# Altium project REUN.468349.001_PSU_Board.PrjPcb
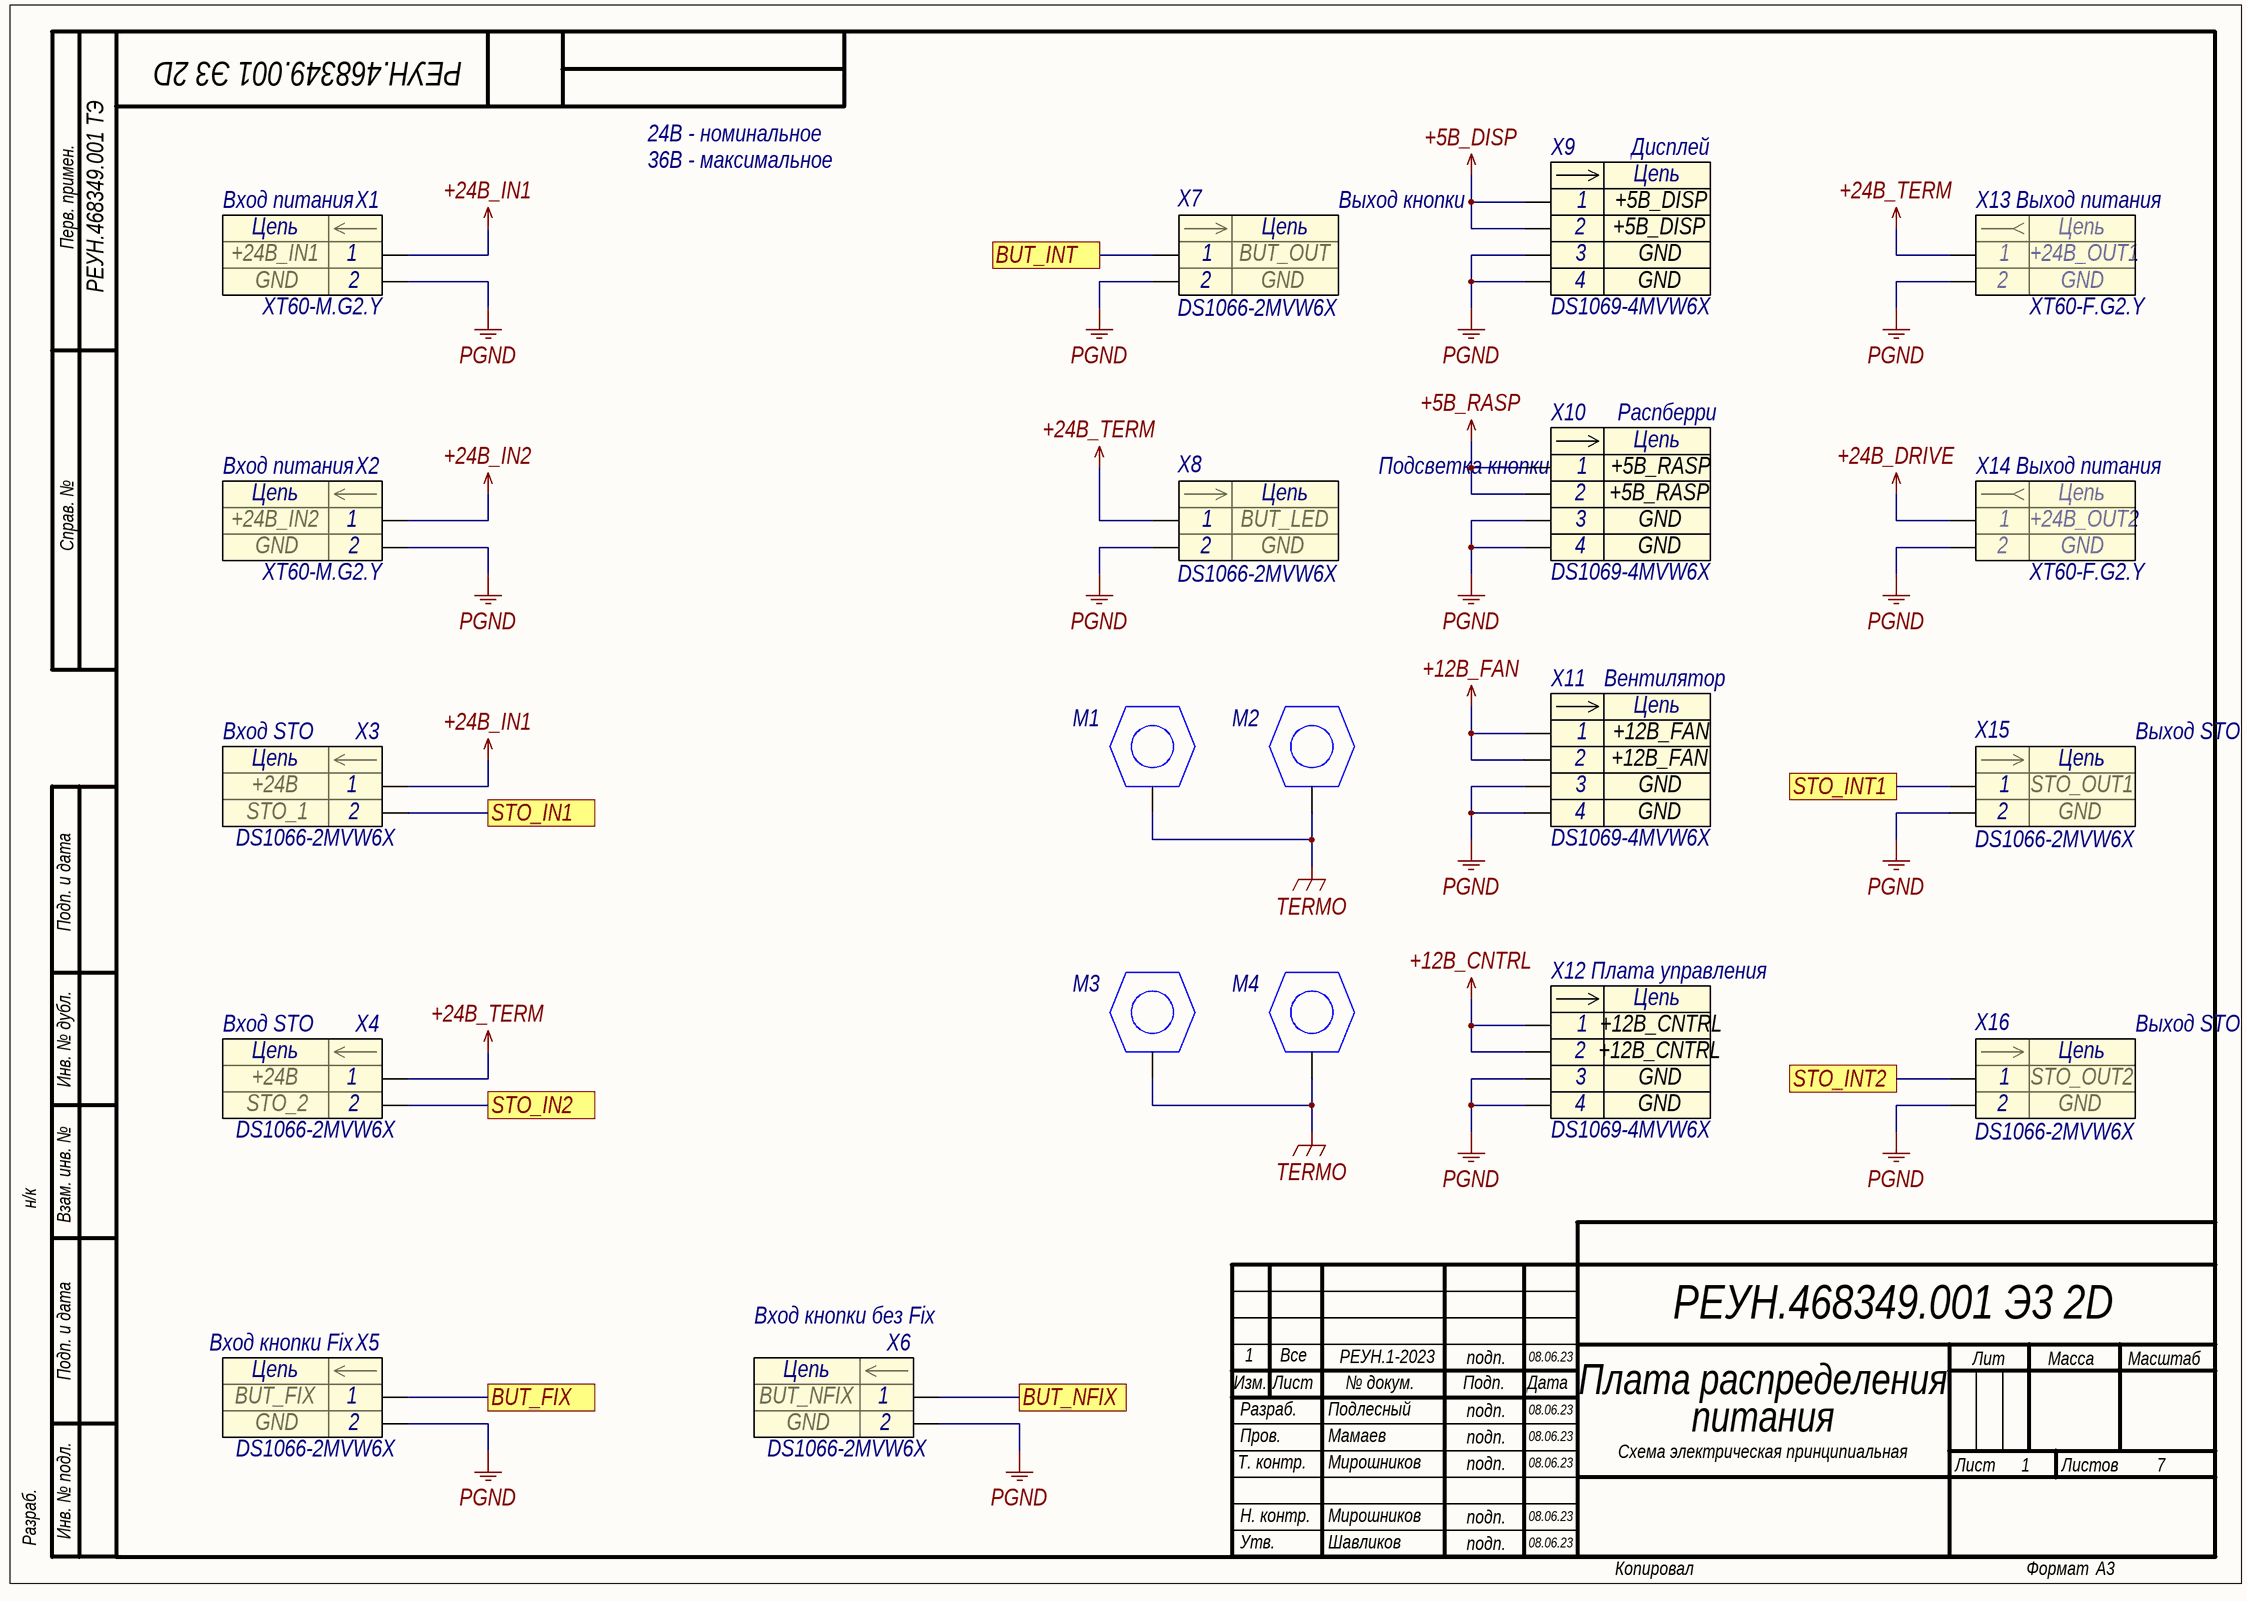
[diagram p0: REUN.468349.001_PSU_Board_Connectors.SchDoc]
BOM_Revision: Rev_1.2; Developer: Подлесный; PCB_Revision: Rev_1.2; SCH_Revision: Rev_1.2; Вид_документа_SCH: Схема электрическая принципиальная; Код_документа_SCH: Э3; Наименование: Плата распределения питания; Наименование1: Плата распределения питания; Обозначение: РЕУН.468349.001 Э3; Обозначение_Код: РЕУН.468349.001 Э3Э3; Перв.Примен.: РЕУН.468349.001; ПервПримен: РЕУН.468349.001; п_Пров_Р: Шавликов; п_Разраб_Р: Подлесный; п_Утв_Р: Шавликов
7 sheets, 182 parts. Net scope: flat (ports and power ports of the same name join across sheets).
Board file: REUN.468349.001_PSU_Board.PcbDoc
Sheets:
  REUN.468349.001_PSU_Board_Connectors.SchDoc
  REUN.468349.001_PSU_Board_Power.SchDoc
  REUN.468349.001_PSU_Board_Logic.SchDoc
  REUN.468349.001_PSU_Board_Button.SchDoc
  REUN.468349.001_PSU_Board_3V3_Logic.SchDoc
  REUN.468349.001_PSU_Board_5B_Interface.SchDoc
  REUN.468349.001_PSU_Board_12B_Interface.SchDoc

## Sheet REUN.468349.001_PSU_Board_Connectors.SchDoc: Плата распределения
size 420 x 297 mm; Date: 10.06.22; ApprovedBy: Шавликов; CheckedBy: Мамаев; DrawnBy: Подлесный; DocumentNumber: РЕУН.468349.001 Э3 2D; SheetNumber: 1; SheetTotal: 7; Title1str: питания; DocumentType: Схема электрическая принципиальная; Format: A3; ImagePath: РЕУН.468349.001 ТЭ

### Parts
M1  SCREW  [SCREW3.5]  (value not drawn)
M2  SCREW  [SCREW3.5]  (value not drawn)
M3  SCREW  [SCREW3.5]  (value not drawn)
M4  SCREW  [SCREW3.5]  (value not drawn)
X1  XT60-M.G2.Y  [XT60-M_TH]
X2  XT60-M.G2.Y  [XT60-M_TH]
X3  DS1066-2MVW6X  [MW-2M]
X4  DS1066-2MVW6X  [MW-2M]
X5  DS1066-2MVW6X  [MW-2M]
X6  DS1066-2MVW6X  [MW-2M]
X7  DS1066-2MVW6X  [MW-2M]
X8  DS1066-2MVW6X  [MW-2M]
X9  DS1069-4MVW6X  [CWF-4]
X10  DS1069-4MVW6X  [CWF-4]
X11  DS1069-4MVW6X  [CWF-4]
X12  DS1069-4MVW6X  [CWF-4]
X13  XT60-F.G2.Y  [XT60-F_TH]
X14  XT60-F.G2.Y  [XT60-F_TH]
X15  DS1066-2MVW6X  [MW-2M]
X16  DS1066-2MVW6X  [MW-2M]

### Ports
BUT_FIX, BUT_INT, BUT_NFIX, STO_IN1, STO_IN2, STO_INT1, STO_INT2

### Nets
+5B_DISP: X9.1 X9.2
+5B_RASP: X10.1 X10.2
+12B_CNTRL: X12.1 X12.2
+12B_FAN: X11.1 X11.2
+24B_DRIVE: X14.1
+24B_IN1: X1.1 X3.1
+24B_IN2: X2.1
+24B_TERM: X4.1 X8.1 X13.1
PGND: X1.2 X2.2 X5.2 X6.2 X7.2 X8.2 X9.3 X9.4 X10.3 X10.4 X11.3 X11.4 X12.3 X12.4 X13.2 X14.2 X15.2 X16.2
TERMO: M1.1 M2.1 M3.1 M4.1
NetDD4_5: X7.1 ; port BUT_INT
NetFU3_2: X15.1 ; port STO_INT1
NetFU4_2: X16.1 ; port STO_INT2
NetR19_1: X6.1 ; port BUT_NFIX
NetR21_1: X5.1 ; port BUT_FIX
NetVD7_2: X3.2 ; port STO_IN1
NetVD8_2: X4.2 ; port STO_IN2

### Notes on the sheet
- Перв. примен.
- 24В - номинальное
- 36В - максимальное
- Дисплей
- (near X1) Вход питания
- (near X7) Выход кнопки
- Выход питания
- Распберри
- Справ. №
- (near X2) Вход питания
- (near X8) Подсветка кнопки
- Вентилятор
- Вход STO
- Выход STO
- Подп. и дата
- Плата управления
- Инв. № дубл.
- н/к
- Взам. инв. №
- Вход кнопки без Fix
- (near X5) Вход кнопки Fix
- 1
- Изм.
- Все
- Лист
- РЕУН.1-2023
- № докум.
- подп.
- Подп.
- 08.06.23
- Дата
- Лит
- Масса
- Масштаб
- Т. контр.
- Пров.
- Разраб.
- Мирошников
- Листов
- Инв. № подл.
- Н. контр.
- Утв.
- Копировал
- Формат
- (in symbol connect76) Цепь
- (in symbol connect215) Цепь
- (in symbol connect216) Цепь
- (in symbol connect233) Цепь

### Library data of the parts
X1 = connect216: Разъем - 2 конт. вилка; Part Name: XT60-M; Manufacture: Amass Electronics; Contact_1: +24B_IN1; Contact_2: GND; Etch: 7.2mm; id: connect216; Part Number: XT60-M.G2.Y
X2 = connect216: Разъем - 2 конт. вилка; Part Name: XT60-M; Manufacture: Amass Electronics; Contact_1: +24B_IN2; Contact_2: GND; Etch: 7.2mm; id: connect216; Part Number: XT60-M.G2.Y
X3 = connect76: Разъем - 2 конт. вилка; Part Name: Вилка на плату прямая 2мм 2pin; Manufacture: Ningbo connfly electronic; Contact_1: +24В; Contact_2: STO_1; Etch: 2mm; id: connect76; Part Number: DS1066-2MVW6X
X4 = connect76: Разъем - 2 конт. вилка; Part Name: Вилка на плату прямая 2мм 2pin; Manufacture: Ningbo connfly electronic; Contact_1: +24В; Contact_2: STO_2; Etch: 2mm; id: connect76; Part Number: DS1066-2MVW6X
X5 = connect76: Разъем - 2 конт. вилка; Part Name: Вилка на плату прямая 2мм 2pin; Manufacture: Ningbo connfly electronic; Contact_1: BUT_FIX; Contact_2: GND; Etch: 2mm; id: connect76; Part Number: DS1066-2MVW6X
X6 = connect76: Разъем - 2 конт. вилка; Part Name: Вилка на плату прямая 2мм 2pin; Manufacture: Ningbo connfly electronic; Contact_1: BUT_NFIX; Contact_2: GND; Etch: 2mm; id: connect76; Part Number: DS1066-2MVW6X
X7 = connect76: Разъем - 2 конт. вилка; Part Name: Вилка на плату прямая 2мм 2pin; Manufacture: Ningbo connfly electronic; Contact_1: BUT_OUT; Contact_2: GND; Etch: 2mm; id: connect76; Part Number: DS1066-2MVW6X
X8 = connect76: Разъем - 2 конт. вилка; Part Name: Вилка на плату прямая 2мм 2pin; Manufacture: Ningbo connfly electronic; Contact_1: BUT_LED; Contact_2: GND; Etch: 2mm; id: connect76; Part Number: DS1066-2MVW6X
X9 = connect233: Разъем - 4 конт. вилка; Part Name: Вилка прямая на плату; Manufacture: Connfly electronic; Contact_1: +5B_DISP; Contact_3: GND; Etch: 2.5мм; Contact_2: +5B_DISP; Contact_4: GND; id: connect233; Part Number: DS1069-4MVW6X
X10 = connect233: Разъем - 4 конт. вилка; Part Name: Вилка прямая на плату; Manufacture: Connfly electronic; Contact_1: +5B_RASP; Contact_3: GND; Etch: 2.5мм; Contact_2: +5B_RASP; Contact_4: GND; id: connect233; Part Number: DS1069-4MVW6X
X11 = connect233: Разъем - 4 конт. вилка; Part Name: Вилка прямая на плату; Manufacture: Connfly electronic; Contact_1: +12B_FAN; Contact_3: GND; Etch: 2.5мм; Contact_2: +12B_FAN; Contact_4: GND; id: connect233; Part Number: DS1069-4MVW6X
X12 = connect233: Разъем - 4 конт. вилка; Part Name: Вилка прямая на плату; Manufacture: Connfly electronic; Contact_1: +12B_CNTRL; Contact_3: GND; Etch: 2.5мм; Contact_2: +12B_CNTRL; Contact_4: GND; id: connect233; Part Number: DS1069-4MVW6X
X13 = connect215: Разъем - 2 конт. розетка; Part Name: XT60-F; Manufacture: Amass Electronics; Contact_1: +24B_OUT1; Contact_2: GND; Etch: 7.2mm; id: connect215; Part Number: XT60-F.G2.Y
X14 = connect215: Разъем - 2 конт. розетка; Part Name: XT60-F; Manufacture: Amass Electronics; Contact_1: +24B_OUT2; Contact_2: GND; Etch: 7.2mm; id: connect215; Part Number: XT60-F.G2.Y
X15 = connect76: Разъем - 2 конт. вилка; Part Name: Вилка на плату прямая 2мм 2pin; Manufacture: Ningbo connfly electronic; Contact_1: STO_OUT1; Contact_2: GND; Etch: 2mm; id: connect76; Part Number: DS1066-2MVW6X
X16 = connect76: Разъем - 2 конт. вилка; Part Name: Вилка на плату прямая 2мм 2pin; Manufacture: Ningbo connfly electronic; Contact_1: STO_OUT2; Contact_2: GND; Etch: 2mm; id: connect76; Part Number: DS1066-2MVW6X

## Sheet REUN.468349.001_PSU_Board_Power.SchDoc
size 420 x 297 mm; DocumentNumber: РЕУН.468349.001 Э3 2D; SheetNumber: 2; Format: A3
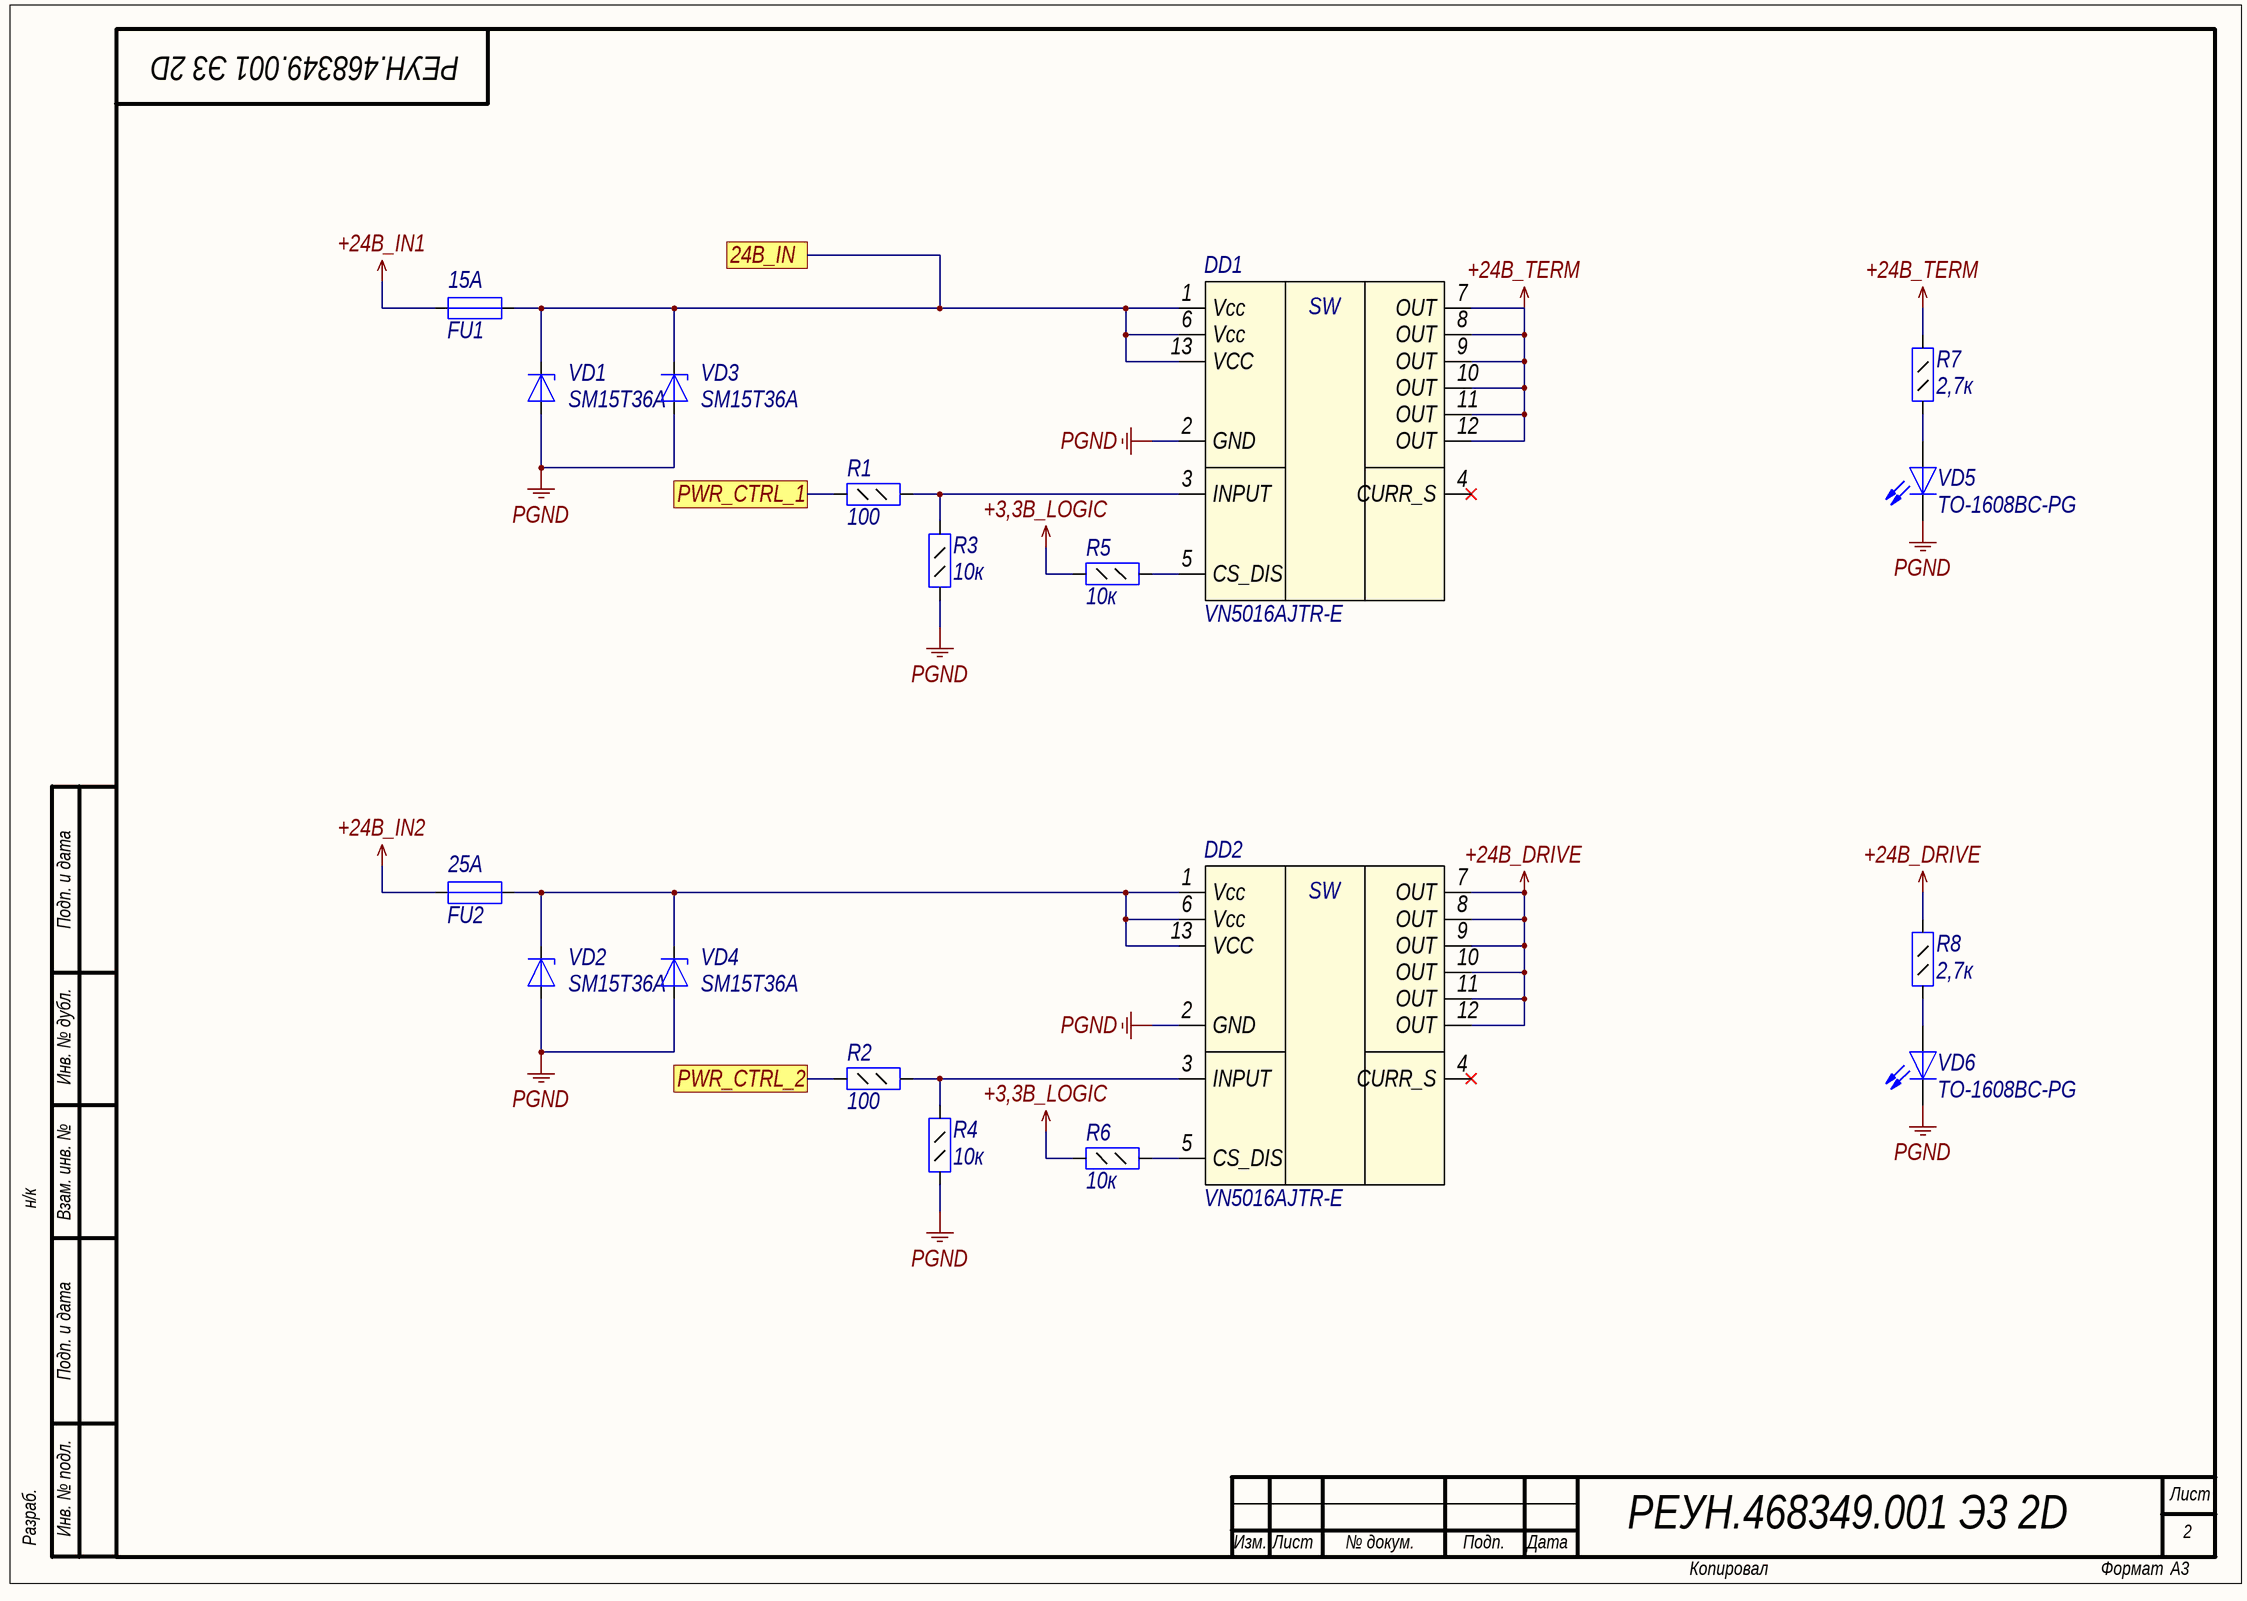
[diagram p1: REUN.468349.001_PSU_Board_Power.SchDoc]

### Parts
DD1  VN5016AJTR-E  [POWERSO12]
DD2  VN5016AJTR-E  [POWERSO12]
FU1  I max: 15А  [F6.3x32]  (hidden comment: Fuse)
FU2  I max: 25A  [F6.3x30]  (hidden comment: Fuse)
R1  value 100  [R0805]  (hidden comment: Resistor_0,125Вт)
R2  value 100  [R0805]  (hidden comment: Resistor_0,125Вт)
R3  value 10к  [R0805]  (hidden comment: Resistor_0,125Вт)
R4  value 10к  [R0805]  (hidden comment: Resistor_0,125Вт)
R5  value 10к  [R0805]  (hidden comment: Resistor_0,125Вт)
R6  value 10к  [R0805]  (hidden comment: Resistor_0,125Вт)
R7  value 2,7к  [R0805]  (hidden comment: Resistor_0,125Вт)
R8  value 2,7к  [R0805]  (hidden comment: Resistor_0,125Вт)
VD1  SM15T36A  [SMC]
VD2  SM15T36A  [SMC]
VD3  SM15T36A  [SMC]
VD4  SM15T36A  [SMC]
VD5  TO-1608BC-PG  [L_0603_GREEN]
VD6  TO-1608BC-PG  [L_0603_GREEN]

### Ports
24B_IN, PWR_CTRL_1, PWR_CTRL_2

### Nets
+3,3B_LOGIC: R5.1 R6.1
+24B_DRIVE: DD2.7(OUT) DD2.8(OUT) DD2.9(OUT) DD2.10(OUT) DD2.11(OUT) DD2.12(OUT) R8.2
+24B_IN1: FU1.1
+24B_IN2: FU2.1
+24B_TERM: DD1.7(OUT) DD1.8(OUT) DD1.9(OUT) DD1.10(OUT) DD1.11(OUT) DD1.12(OUT) R7.2
PGND: DD1.2(GND) DD2.2(GND) R3.1 R4.1 VD1.2(A) VD2.2(A) VD3.2(A) VD4.2(A) VD5.1(K) VD6.1(K)
NetC12_1: DD1.1(Vcc) DD1.6(Vcc) DD1.13(VCC) FU1.2 VD1.1(K) VD3.1(K) ; port 24B_IN
NetDD1_3: DD1.3(INPUT) R1.2 R3.2
NetDD1_5: DD1.5(CS_DIS) R5.2
NetDD2_1: DD2.1(Vcc) DD2.6(Vcc) DD2.13(VCC) FU2.2 VD2.1(K) VD4.1(K)
NetDD2_3: DD2.3(INPUT) R2.2 R4.2
NetDD2_5: DD2.5(CS_DIS) R6.2
NetDD3_3: R1.1 ; port PWR_CTRL_1
NetDD3_6: R2.1 ; port PWR_CTRL_2
NetR7_1: R7.1 VD5.2(A)
NetR8_1: R8.1 VD6.2(A)

Not connected (* = marked no-connect by the designer): DD1 4(CURR_S)*; DD2 4(CURR_S)*

### Notes on the sheet
- Подп. и дата
- Инв. № дубл.
- н/к
- Взам. инв. №
- Разраб.
- Инв. № подл.
- Лист
- Изм.
- № докум.
- Подп.
- Дата
- Копировал
- Формат
- (in symbol pwrsw5) SW

### Library data of the parts
DD1 DD2 = pwrsw5: Single channel high side driver with analog / current sense for automotive applications; Manufacturer: STMicroelectronics; Overvoltage protection: 36B; Output clamp: 52В; Operating voltage: 4,5-36B; On-state resistance: 0,016Ohm; Load current: 65A; Input Logic: 3B CMOS; Short circuit: 91А; Current sense ratio: 45000; id: pwrsw5; Part Name: Driver with analog current sense; Part Number: VN5016AJTR-E
FU1 = fuse26: Предохранитель; Part Name: Glass Miniature Fuse-Links; Manufacture: Siba; Part Number: 189000.15; id: fuse26; V max: 250В; Slow blow(min): 80ms 10*I
FU2 = fuse28: Предохранитель; Part Name: Fast Blow Fuse; Manufacture: KLS electronic co ltd; Part Number: KLS5-1046-25000; id: fuse28; V max: 250В
R1 R2 = res49: Резистор; Manufacture: Yageo; Part Number: RC0805FR-07100RL; id: res49; Accuracy: 0.01; Part Name: Resistor; Power: 0,125Вт
R3-R6 = res101: Резистор; Manufacture: Yageo; Part Number: RC0805FR-0710KL; id: res101; Accuracy: 0.01; Part Name: Resistor; Power: 0,125Вт
R7 R8 = res87: Резистор; Manufacture: Yageo; Part Number: RC0805FR-072K7; id: res87; Accuracy: 0.01; Part Name: Resistor; Power: 0,125Вт
VD1-VD4 = SM15T36A: Cтабилитрон (лавинный выпрямительный диод) односторонний; Part Name: TVS diode Unidirectional; Manufacture: ST Microelectronics; id: tvs258; Leakage Current: 0.2uA; Stand-off Voltage: 34.2B; Breakdown Voltage: 36B; Clamping voltage: 37.8B; Peak Pulse Power: 1500W; Number of diodes: 1; Part Number: SM15T36A
VD5 VD6 = diode43: Светодиод; Part Name: LED green 0603; Manufacture: OASISTEK; id: diode43; Part Number: TO-1608BC-PG

## Sheet REUN.468349.001_PSU_Board_Logic.SchDoc
size 420 x 297 mm; DocumentNumber: РЕУН.468349.001 Э3 2D; SheetNumber: 3; Format: A3
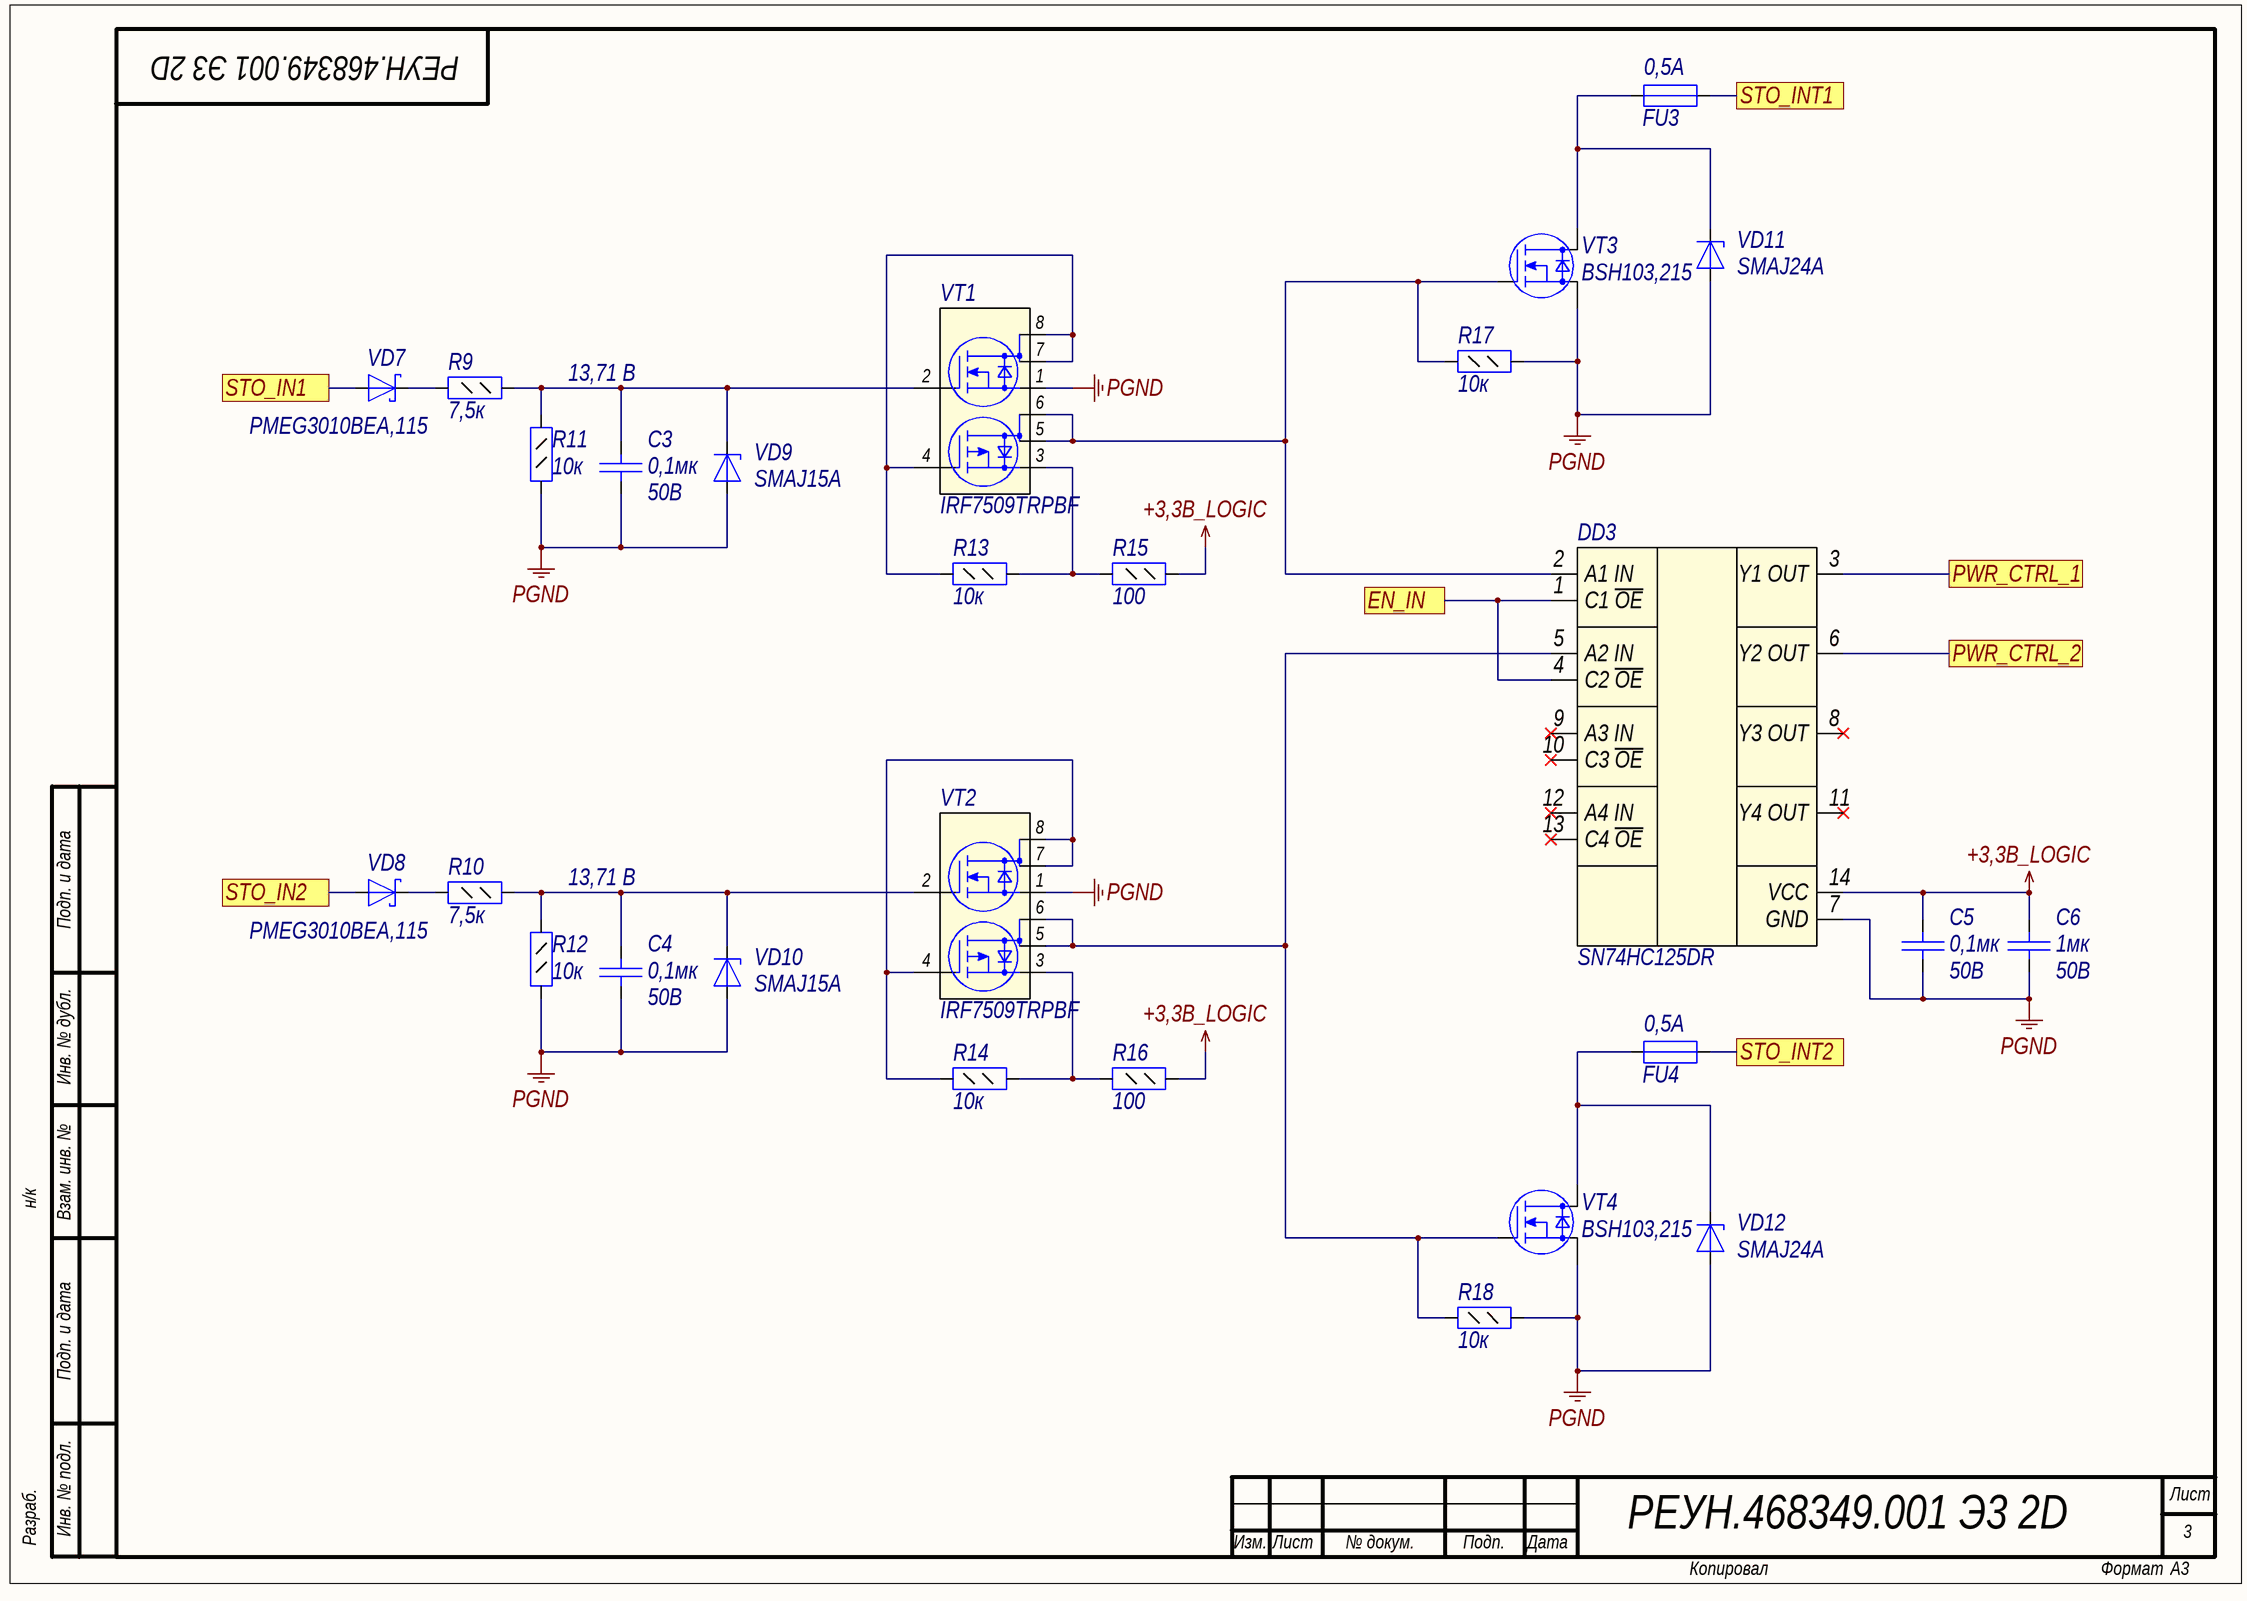
[diagram p2: REUN.468349.001_PSU_Board_Logic.SchDoc]

### Parts
C3  Voltage: 50B  [C0805]  (hidden comment: 0,1мк)
C4  Voltage: 50B  [C0805]  (hidden comment: 0,1мк)
C5  Voltage: 50B  [C0805]  (hidden comment: 0,1мк)
C6  Voltage: 50B  [C0805]  (hidden comment: 1мк)
DD3  SN74HC125DR  [SO14]
FU3  I hold: 0,5A  [FUSE812]  (hidden comment: Fuse)
FU4  I hold: 0,5A  [FUSE812]  (hidden comment: Fuse)
R9  value 7,5к  [R0805]  (hidden comment: Resistor_0,125Вт)
R10  value 7,5к  [R0805]  (hidden comment: Resistor_0,125Вт)
R11  value 10к  [R0805]  (hidden comment: Resistor_0,125Вт)
R12  value 10к  [R0805]  (hidden comment: Resistor_0,125Вт)
R13  value 10к  [R0805]  (hidden comment: Resistor_0,125Вт)
R14  value 10к  [R0805]  (hidden comment: Resistor_0,125Вт)
R15  value 100  [R0805]  (hidden comment: Resistor_0,125Вт)
R16  value 100  [R0805]  (hidden comment: Resistor_0,125Вт)
R17  value 10к  [R0805]  (hidden comment: Resistor_0,125Вт)
R18  value 10к  [R0805]  (hidden comment: Resistor_0,125Вт)
VD7  PMEG3010BEA,115  [SOD-323]
VD8  PMEG3010BEA,115  [SOD-323]
VD9  SMAJ15A  [SMA]
VD10  SMAJ15A  [SMA]
VD11  SMAJ24A  [SMA]
VD12  SMAJ24A  [SMA]
VT1  IRF7509TRPBF  [Micro8]
VT2  IRF7509TRPBF  [Micro8]
VT3  BSH103,215  [SOT23-3]
VT4  BSH103,215  [SOT23-3]

### Ports
EN_IN, PWR_CTRL_1, PWR_CTRL_2, STO_IN1, STO_IN2, STO_INT1, STO_INT2

### Nets
+3,3B_LOGIC: C5.2 C6.2 DD3.14(VCC) R15.1 R16.1
PGND: C3.1 C4.1 C5.1 C6.1 DD3.7(GND) R11.2 R12.2 R17.2 R18.2 VD9.2(A) VD10.2(A) VD11.2(A) VD12.2(A) VT1.1(S1) VT2.1(S1) VT3.2(S) VT4.2(S)
NetC3_2: C3.2 R9.1 R11.1 VD9.1(K) VT1.2(G1)
NetC4_2: C4.2 R10.1 R12.1 VD10.1(K) VT2.2(G1)
NetC11_2: DD3.1(C1_~{OE}) DD3.4(C2_~{OE}) ; port EN_IN
NetDD3_2: DD3.2(A1_IN) R17.1 VT1.5(D2) VT1.6(D2) VT3.1(G)
NetDD3_3: DD3.3(Y1_OUT) ; port PWR_CTRL_1
NetDD3_5: DD3.5(A2_IN) R18.1 VT2.5(D2) VT2.6(D2) VT4.1(G)
NetDD3_6: DD3.6(Y2_OUT) ; port PWR_CTRL_2
NetFU3_1: FU3.1 VD11.1(K) VT3.3(D)
NetFU3_2: FU3.2 ; port STO_INT1
NetFU4_1: FU4.1 VD12.1(K) VT4.3(D)
NetFU4_2: FU4.2 ; port STO_INT2
NetR9_2: R9.2 VD7.1(K)
NetR10_2: R10.2 VD8.1(K)
NetR13_1: R13.1 VT1.4(G2) VT1.7(D1) VT1.8(D1)
NetR13_2: R13.2 R15.2 VT1.3(S2)
NetR14_1: R14.1 VT2.4(G2) VT2.7(D1) VT2.8(D1)
NetR14_2: R14.2 R16.2 VT2.3(S2)
NetVD7_2: VD7.2(A) ; port STO_IN1
NetVD8_2: VD8.2(A) ; port STO_IN2

Not connected (* = marked no-connect by the designer): DD3 8(Y3_OUT)* 9(A3_IN)* 10(C3_~{OE})* 11(Y4_OUT)* 12(A4_IN)* 13(C4_~{OE})*

### Notes on the sheet
- 13,71 B
- Подп. и дата
- Инв. № дубл.
- н/к
- Взам. инв. №
- Разраб.
- Инв. № подл.
- Лист
- Изм.
- № докум.
- Подп.
- Дата
- Копировал
- Формат

### Library data of the parts
C3-C5 = cap141: Конденсатор; Part Name: Ceramic; Manufacture: Murata; Part Number: GRM21BR71H104KA01K; id: cap141; TKE: X7R; Value: 0,1мк
C6 = cap151: Конденсатор; Part Name: Ceramic; Manufacture: Murata; Part Number: GRM21BR71H105KA12L; id: cap151; TKE: X7R; Value: 1мк
DD3 = logic16: Quad Tri-State Buffer IC; Manufacture: Nexperia; Type of Logic: 3V3 CMOS; Number of elements: 4; Input High Level: 1,75B; Input Low Level: 1,55B; Output High Level: 3,3B; Output Low Level: 0,1B; Toff: 41ns; Power Supply: 2В-6В; id: logic16; Part Name: Quad Tri-State Buffer; Ton: 41ns; Part Number: SN74HC125DR; Temperature: -40...+125
FU3 FU4 = fuse8: Предохранитель; Part Name: Resettable Fuses; Manufacture: Bourns; Part Number: MF-MSMF050; id: fuse8; V max: 15B; I max: 100A; I trip: 1A; Resistance: 0,15Ohms
R9 R10 = res98: Резистор; Manufacture: Yageo; Part Number: RC0805FR-077K5; id: res98; Accuracy: 0.01; Part Name: Resistor; Power: 0,125Вт
R11-R14 R17 R18 = res101: as R3 on sheet REUN.468349.001_PSU_Board_Power; Part Name: Resistor; Power: 0,125Вт
R15 R16 = res49: as R1 on sheet REUN.468349.001_PSU_Board_Power; Part Name: Resistor; Power: 0,125Вт
VD7 VD8 = diode63: Диод Шоттки; Part Name: Diode Schottky; Manufacture: NXP Semiconductor; Max Reverse Voltage: 30B; Forward Voltage: 0,13B; Forward Current: 1А; Peak Current: 10A; Reverse Current: 1,5mA; Number: 1; id: diode63; Temp MAX: +150; Temp MIN: -65; Part Number: PMEG3010BEA,115
VD9 VD10 = SMAJ15A: Cтабилитрон (лавинный выпрямительный диод) односторонний; Part Name: TVS diode Unidirectional; Manufacture: ST Microelectronics; id: tvs130; Leakage Current: 0,2uA; Stand-off Voltage: 15B; Breakdown Voltage: 17,6B; Clamping voltage: 24,4B; Dynamic resistance: 0,361Ohm; Peak Pulse Power: 400W; Number of diodes: 1; Part Number: SMAJ15A
VD11 VD12 = SMAJ24A: Cтабилитрон (лавинный выпрямительный диод) односторонний; Part Name: TVS diode Unidirectional; Manufacture: ST Microelectronics; id: tvs134; Leakage Current: 0,2uA; Stand-off Voltage: 24B; Breakdown Voltage: 28,1B; Clamping voltage: 38,9B; Dynamic resistance: 0,912Ohm; Peak Pulse Power: 400W; Number of diodes: 1; Part Number: SMAJ24A
VT1 VT2 = mosfert3: Комплементарная сборка МОП; Manufacturer: International Rectifier; Structure: n-p-channel; V drain-source max: 30B; Rds: 0,11 Ohm; Gate-to-source voltage: (+-)20B; Continuous drain current: 2A; Pulsed drain current: 16A; Power dissipation: 1,25W; id: mosfert3; Part Number: IRF7509TRPBF
VT3 VT4 = mosfert36: N-MOSFET; Manufacturer: Nexperia; Structure: n-channel; V drain-source max: 30B; Rds: 0,5Ohm; Gate-to-source voltage: (+-)8B; Continuous drain current: 0,85A; Total gate charge: 2100pC; Pulsed drain current: 3,4A; Power dissipation: 0,5W; id: mosfert36; Part Number: BSH103,215

## Sheet REUN.468349.001_PSU_Board_Button.SchDoc
size 420 x 297 mm; DocumentNumber: РЕУН.468349.001 Э3 2D; SheetNumber: 4; Format: A3
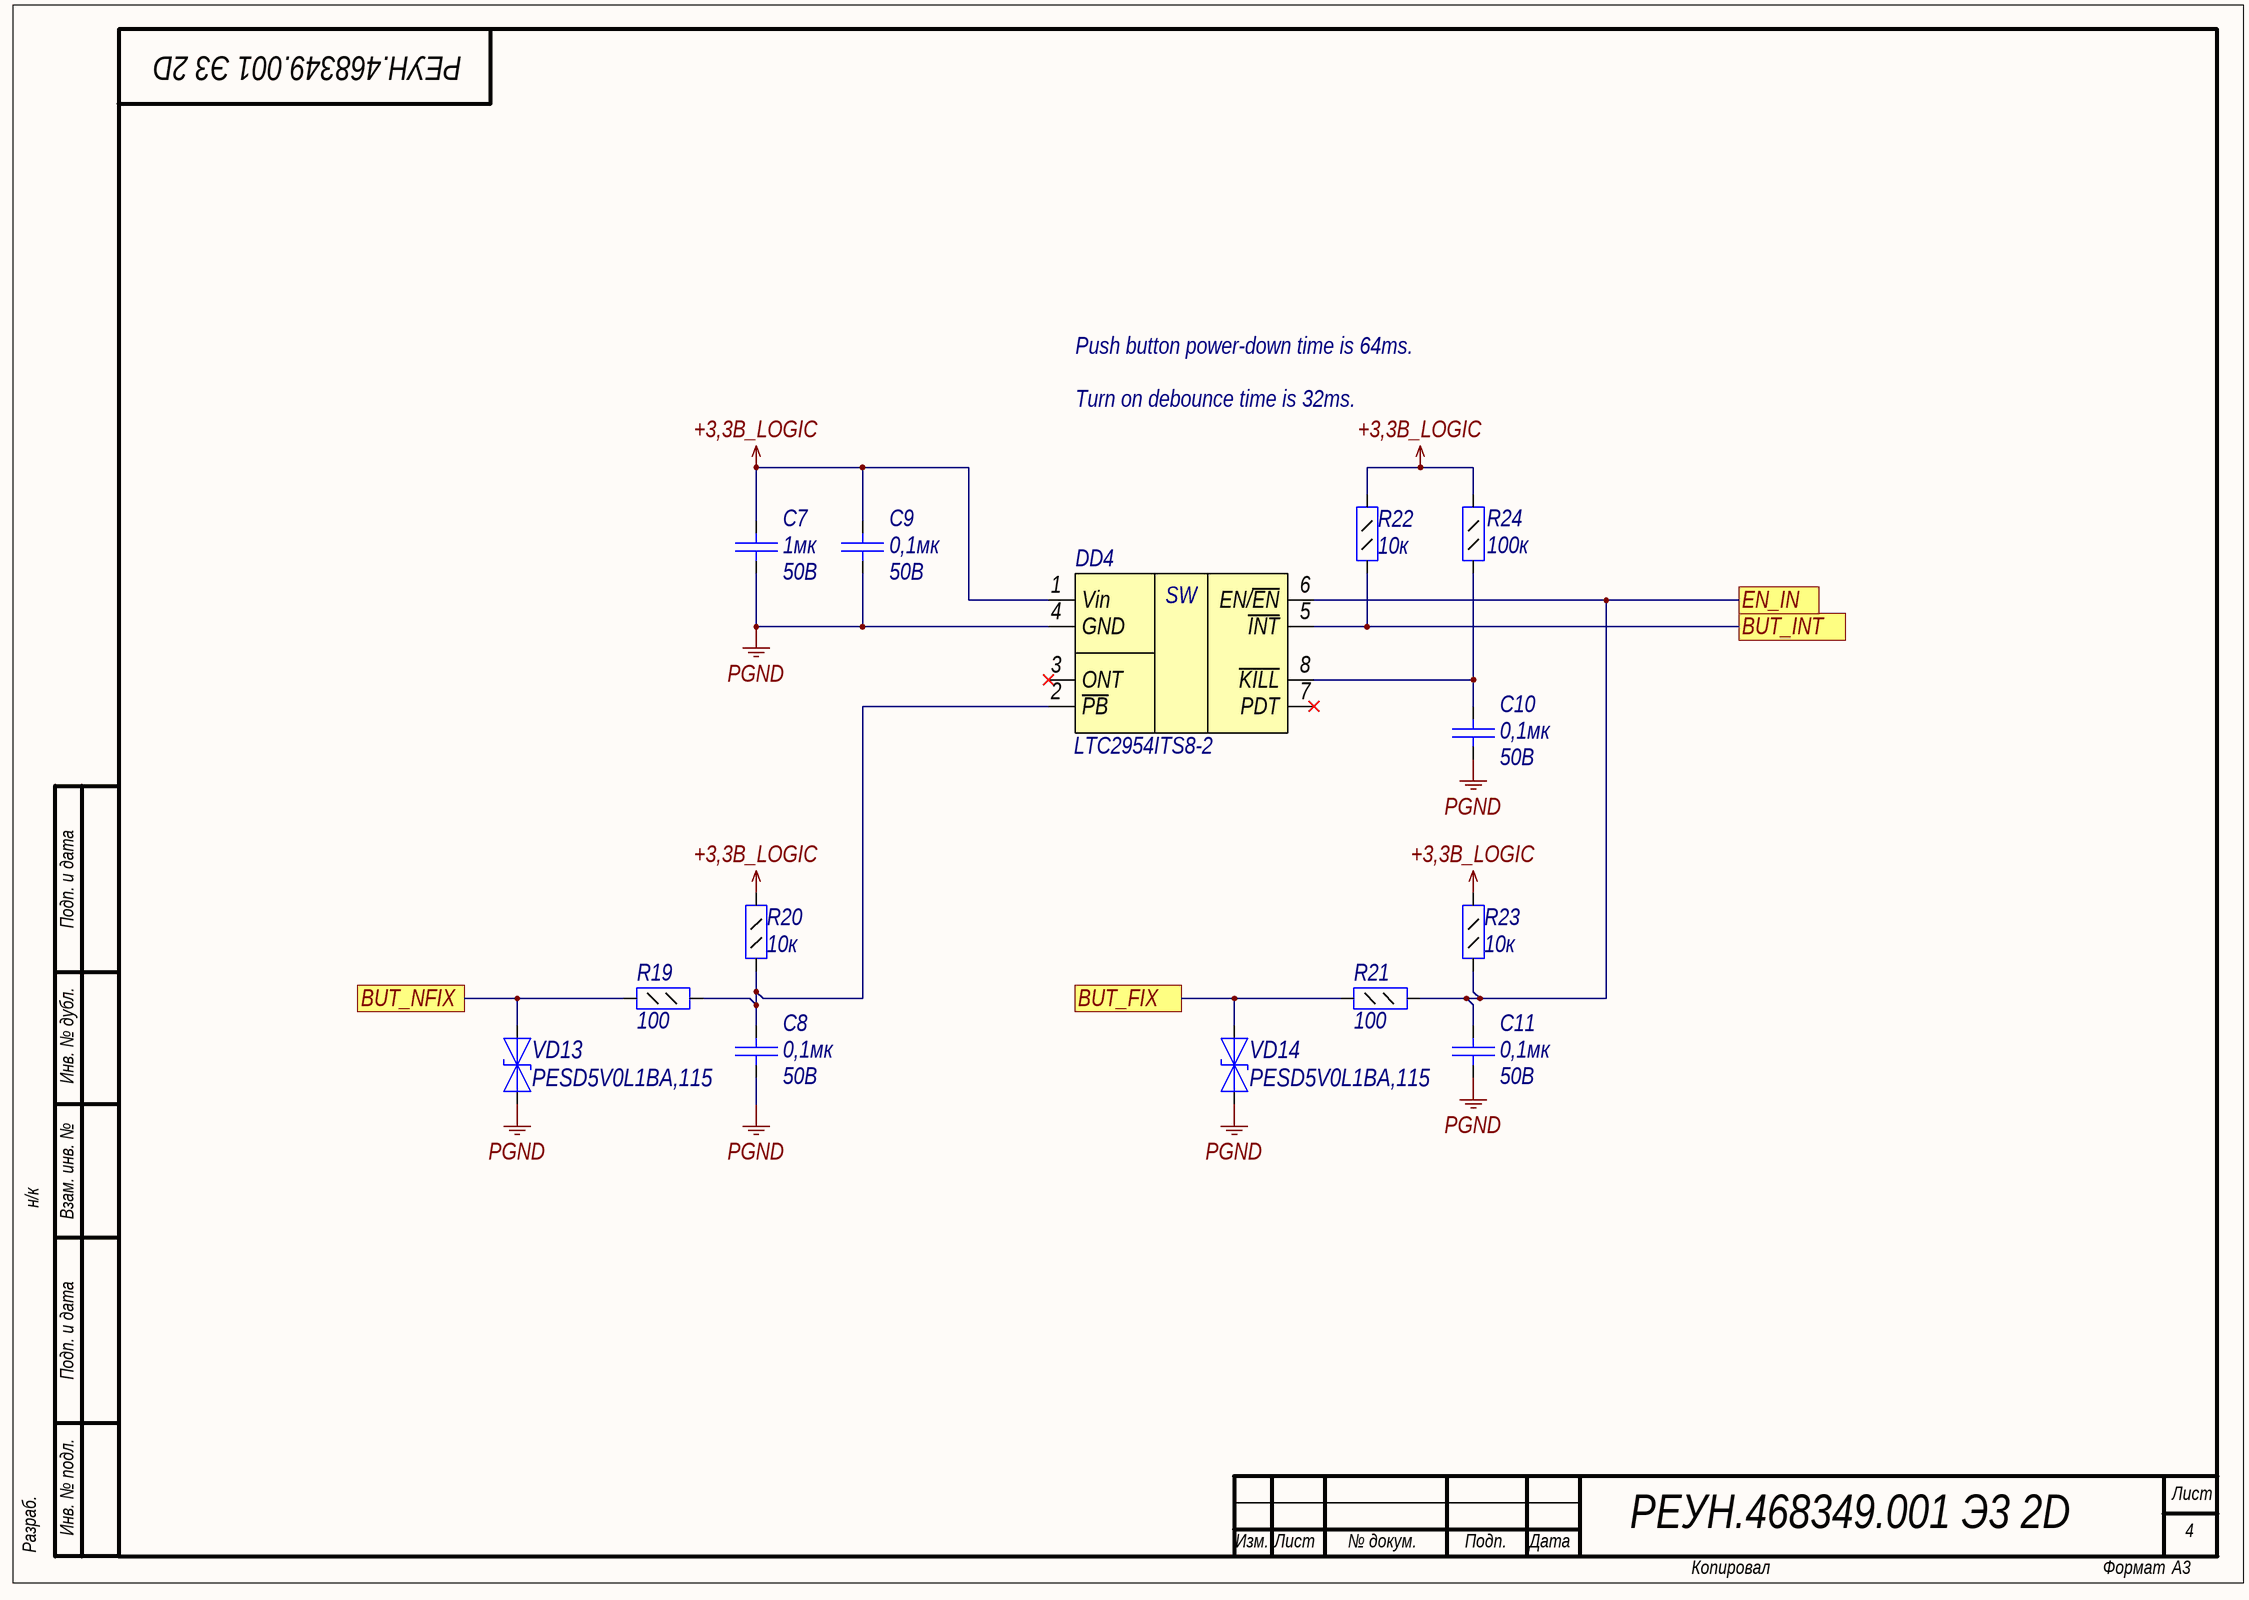
[diagram p3: REUN.468349.001_PSU_Board_Button.SchDoc]

### Parts
C7  Voltage: 50B  [C0805]  (hidden comment: 1мк)
C8  Voltage: 50B  [C0805]  (hidden comment: 0,1мк)
C9  Voltage: 50B  [C0805]  (hidden comment: 0,1мк)
C10  Voltage: 50B  [C0805]  (hidden comment: 0,1мк)
C11  Voltage: 50B  [C0805]  (hidden comment: 0,1мк)
DD4  LTC2954ITS8-2  [SOT-23-8]
R19  value 100  [R0805]  (hidden comment: Resistor_0,125Вт)
R20  value 10к  [R0805]  (hidden comment: Resistor_0,125Вт)
R21  value 100  [R0805]  (hidden comment: Resistor_0,125Вт)
R22  value 10к  [R0805]  (hidden comment: Resistor_0,125Вт)
R23  value 10к  [R0805]  (hidden comment: Resistor_0,125Вт)
R24  value 100к  [R0805]  (hidden comment: Resistor_0,125Вт)
VD13  PESD5V0L1BA,115  [SOD-323]
VD14  PESD5V0L1BA,115  [SOD-323]

### Ports
BUT_FIX, BUT_INT, BUT_NFIX, EN_IN

### Nets
+3,3B_LOGIC: C7.2 C9.2 DD4.1(Vin) R20.2 R22.2 R23.2 R24.2
PGND: C7.1 C8.1 C9.1 C10.1 C11.1 DD4.4(GND) VD13.2(A) VD14.2(A)
NetC8_2: C8.2 DD4.2(~{PB}) R19.2 R20.1
NetC10_2: C10.2 DD4.8(~{KILL}) R24.1
NetC11_2: C11.2 DD4.6(EN/~{EN}) R21.2 R23.1 ; port EN_IN
NetDD4_5: DD4.5(~{INT}) R22.1 ; port BUT_INT
NetR19_1: R19.1 VD13.1(K) ; port BUT_NFIX
NetR21_1: R21.1 VD14.1(K) ; port BUT_FIX

Not connected (* = marked no-connect by the designer): DD4 3(ONT)* 7(PDT)*

### Notes on the sheet
- Push button power-down time is 64ms.
- Turn on debounce time is 32ms.
- Подп. и дата
- Инв. № дубл.
- н/к
- Взам. инв. №
- Разраб.
- Инв. № подл.
- Лист
- Изм.
- № докум.
- Подп.
- Дата
- Копировал
- Формат
- (in symbol btn11) SW

### Library data of the parts
C7 = cap151: as C6 on sheet REUN.468349.001_PSU_Board_Logic; Value: 1мк
C8-C11 = cap141: as C3 on sheet REUN.468349.001_PSU_Board_Logic; Value: 0,1мк
DD4 = btn11: Pushbutton On/Off Controller with µP Interrupt; Manufacture: Analog Devices; id: btn11; Part Name: Pushbutton On/Off Controller; Part Number: LTC2954ITS8-2
R19 = res49: Резистор; Manufacture: Yageo; Part Number: RC0805FR-07100RL; Accuracy: 0.01; id: res49; Part Name: Resistor; Power: 0,125Вт
R20 R22 R23 = res101: as R3 on sheet REUN.468349.001_PSU_Board_Power; Part Name: Resistor; Power: 0,125Вт
R21 = res49: as R1 on sheet REUN.468349.001_PSU_Board_Power; Part Name: Resistor; Power: 0,125Вт
R24 = res125: Резистор; Manufacture: Yageo; Part Number: RC0805FR-07100KL; id: res125; Accuracy: 0.01; Part Name: Resistor; Power: 0,125Вт
VD13 VD14 = PESD5V0L1BA,115: Cтабилитрон (диод выпрямительный лавинный) двусторонний; Part Name: TVS diode Bidirectional; Manufacture: Nexperia; id: tvs286; Leakage Current: 1uA; Stand-off Voltage: 5B; Breakdown Voltage: 8,2B; Clamping voltage: 10B; Peak Pulse Power: 500W; Number of diodes: 1; Part Number: PESD5V0L1BA,115

## Sheet REUN.468349.001_PSU_Board_3V3_Logic.SchDoc
size 420 x 297 mm; DocumentNumber: РЕУН.468349.001 Э3 2D; SheetNumber: 5; Format: A3
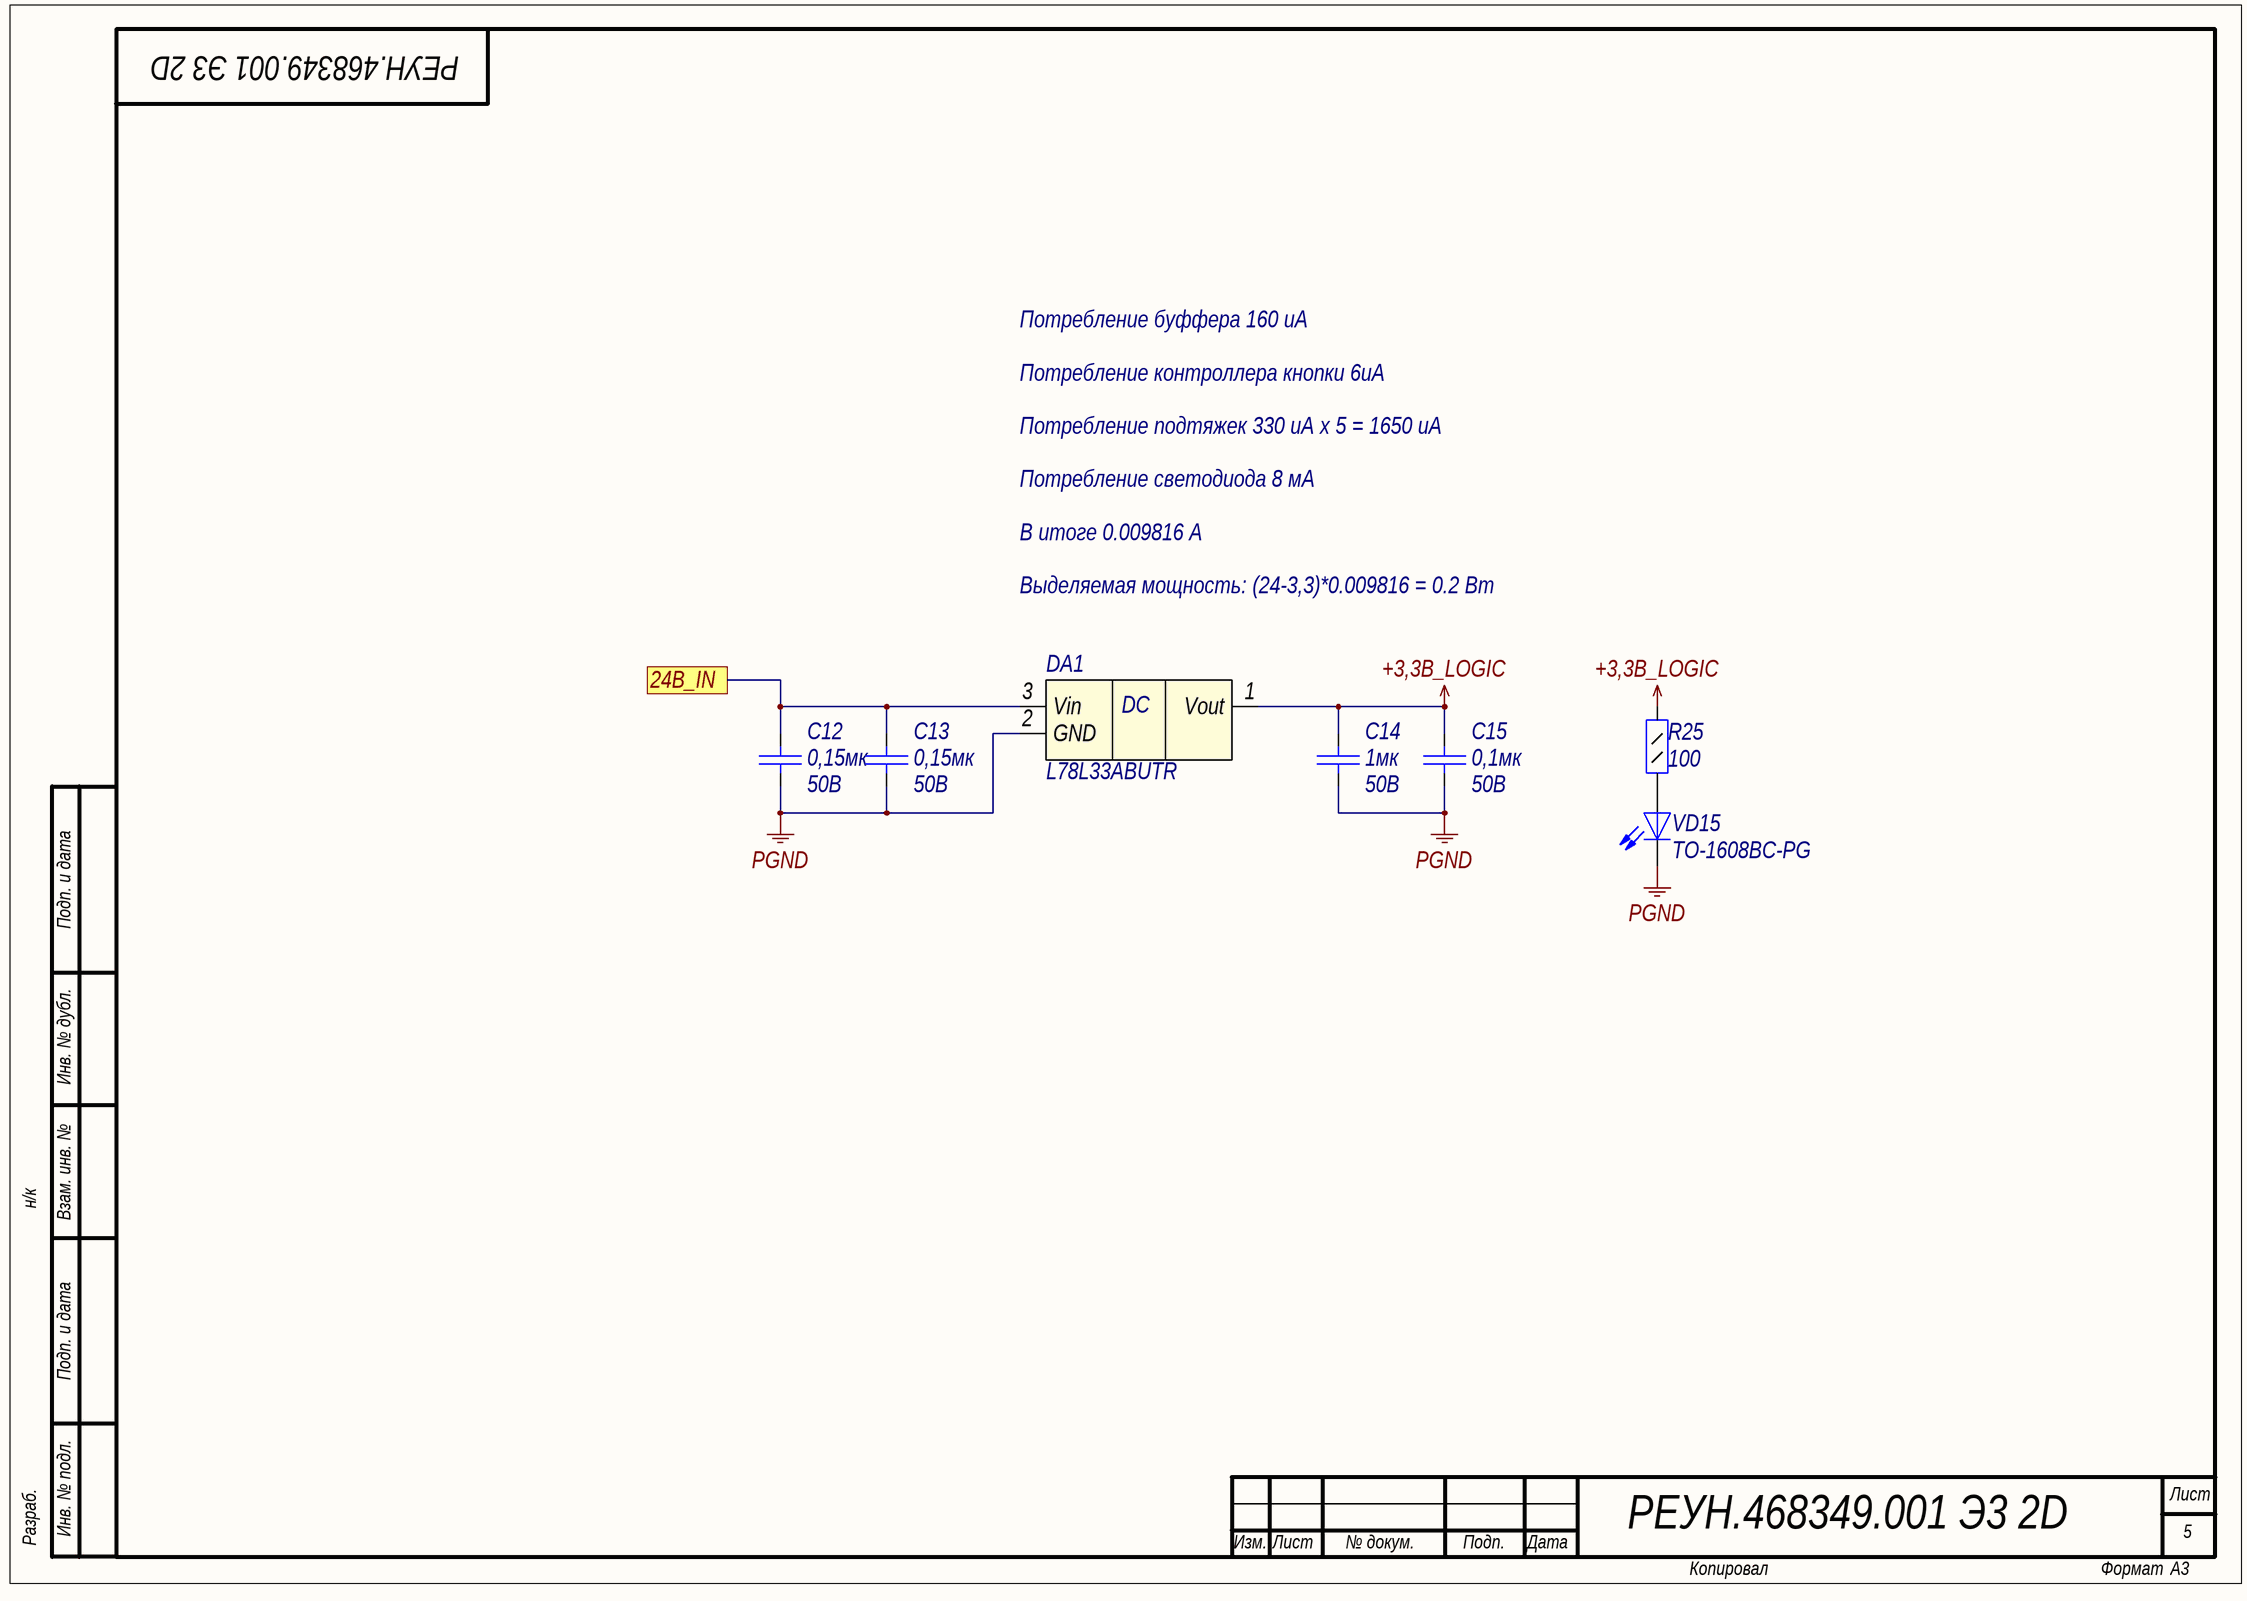
[diagram p4: REUN.468349.001_PSU_Board_3V3_Logic.SchDoc]

### Parts
C12  Voltage: 50B  [C0805]  (hidden comment: 0,15мк)
C13  Voltage: 50B  [C0805]  (hidden comment: 0,15мк)
C14  Voltage: 50B  [C0805]  (hidden comment: 1мк)
C15  Voltage: 50B  [C0805]  (hidden comment: 0,1мк)
DA1  L78L33ABUTR  [SOT-89-3]
R25  value 100  [R0805]  (hidden comment: Resistor_0,125Вт)
VD15  TO-1608BC-PG  [L_0603_GREEN]

### Ports
24B_IN

### Nets
+3,3B_LOGIC: C14.2 C15.2 DA1.1(Vout) R25.2
PGND: C12.2 C13.2 C14.1 C15.1 DA1.2(GND) VD15.1(K)
NetC12_1: C12.1 C13.1 DA1.3(Vin) ; port 24B_IN
NetR25_1: R25.1 VD15.2(A)

### Notes on the sheet
- Потребление буффера 160 uA
- Потребление контроллера кнопки 6uA
- Потребление подтяжек 330 uA x 5 = 1650 uA
- Потребление cветодиода 8 мА
- В итоге 0.009816 А
- Выделяемая мощность: (24-3,3)*0.009816 = 0.2 Вт
- Подп. и дата
- Инв. № дубл.
- н/к
- Взам. инв. №
- Разраб.
- Инв. № подл.
- Лист
- Изм.
- № докум.
- Подп.
- Дата
- Копировал
- Формат
- (in symbol pwr180) DC

### Library data of the parts
C12 C13 = cap142: Конденсатор; Part Name: Ceramic; Manufacture: Murata; Part Number: GRM21BR71H154K; id: cap142; TKE: X7R; Value: 0,15мк
C14 = cap151: as C6 on sheet REUN.468349.001_PSU_Board_Logic; Value: 1мк
C15 = cap141: as C3 on sheet REUN.468349.001_PSU_Board_Logic; Value: 0,1мк
DA1 = pwr180: Cтабилизатор напряжения (+3,3В; 0.1А), 4%, (-40...+125C); Part Name: Positive voltage regulators; Manufacturer: ST Microelectronics; id: pwr180; Input Voltage: 30B; Output Voltage: 3,3B; Dropout Voltage: 2V; Current: 100mA; Quiescent current: 6mA; Type: Linear; Part Number: L78L33ABUTR
R25 = res49: as R1 on sheet REUN.468349.001_PSU_Board_Power; Part Name: Resistor; Power: 0,125Вт
VD15 = diode43: as VD5 on sheet REUN.468349.001_PSU_Board_Power; id: diode43; Part Number: TO-1608BC-PG

## Sheet REUN.468349.001_PSU_Board_5B_Interface.SchDoc
size 420 x 297 mm; DocumentNumber: РЕУН.468349.001 Э3 2D; SheetNumber: 6; Format: A3
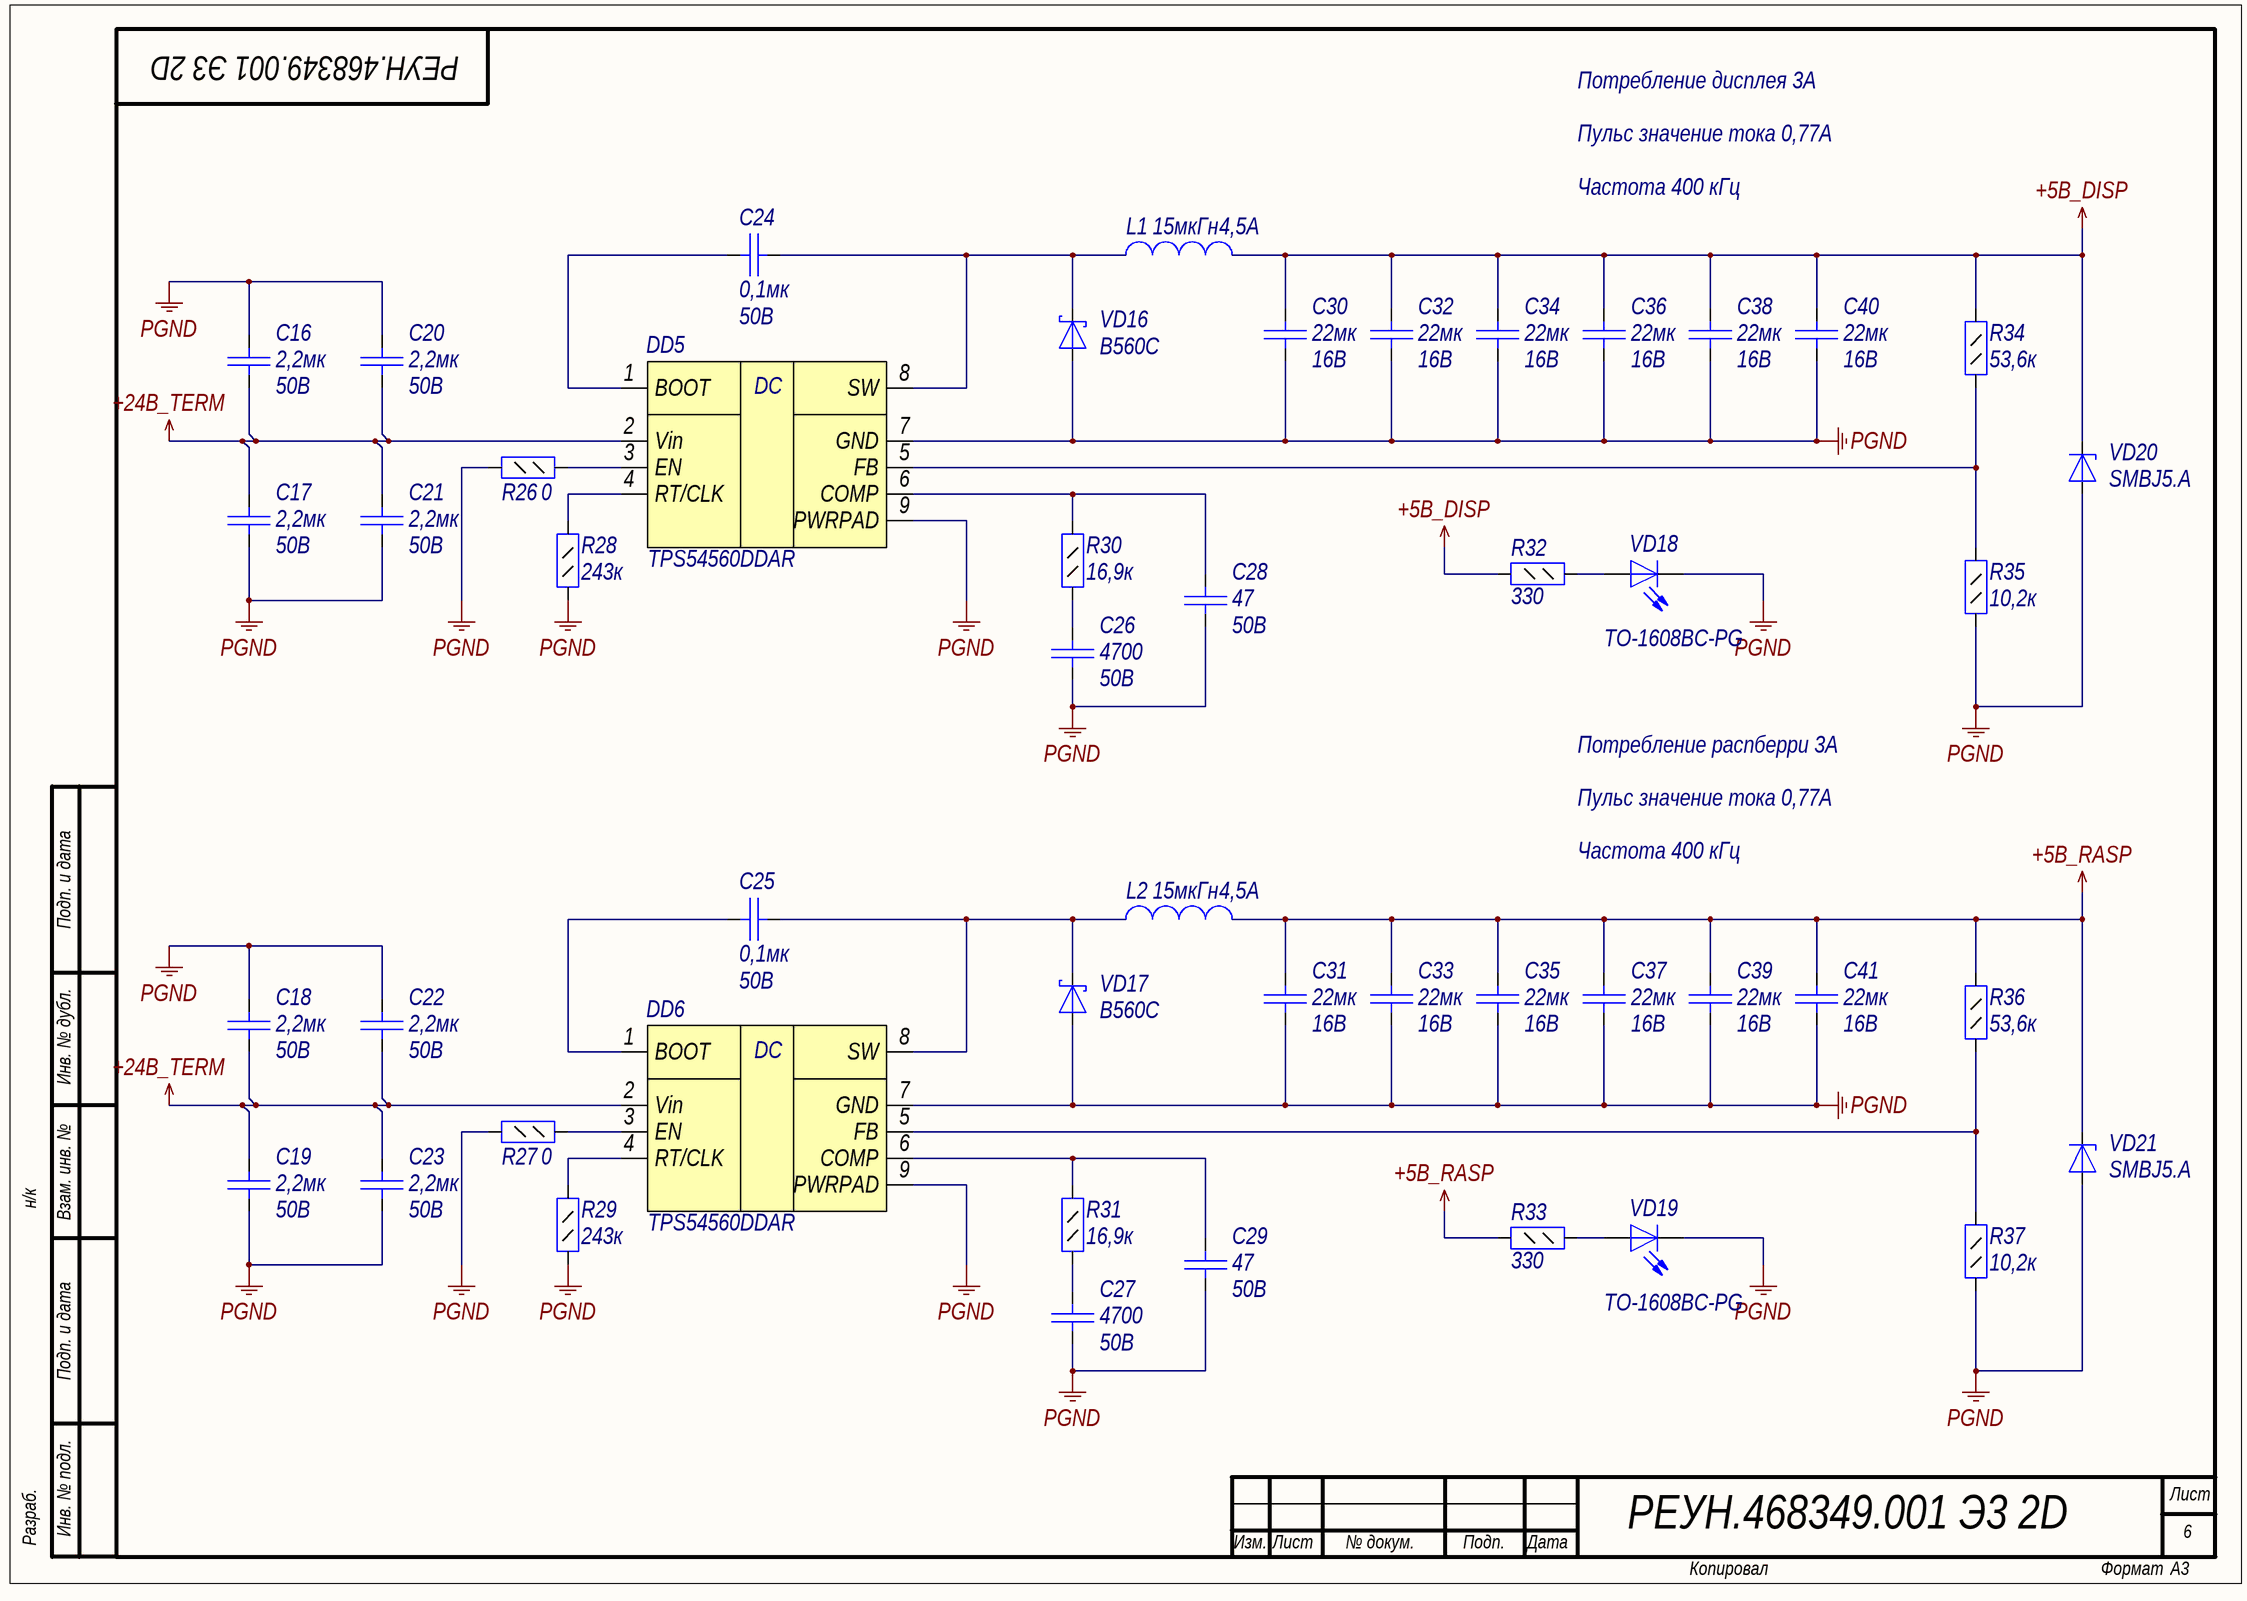
[diagram p5: REUN.468349.001_PSU_Board_5B_Interface.SchDoc]

### Parts
C16  Voltage: 50B  [C1206]  (hidden comment: 2,2мк)
C17  Voltage: 50B  [C1206]  (hidden comment: 2,2мк)
C18  Voltage: 50B  [C1206]  (hidden comment: 2,2мк)
C19  Voltage: 50B  [C1206]  (hidden comment: 2,2мк)
C20  Voltage: 50B  [C1206]  (hidden comment: 2,2мк)
C21  Voltage: 50B  [C1206]  (hidden comment: 2,2мк)
C22  Voltage: 50B  [C1206]  (hidden comment: 2,2мк)
C23  Voltage: 50B  [C1206]  (hidden comment: 2,2мк)
C24  Voltage: 50B  [C0805]  (hidden comment: 0,1мк)
C25  Voltage: 50B  [C0805]  (hidden comment: 0,1мк)
C26  Voltage: 50B  [C0805]  (hidden comment: 4700)
C27  Voltage: 50B  [C0805]  (hidden comment: 4700)
C28  Voltage: 50B  [C0805]  (hidden comment: 47)
C29  Voltage: 50B  [C0805]  (hidden comment: 47)
C30  Voltage: 16B  [C1210]  (hidden comment: 22мк)
C31  Voltage: 16B  [C1210]  (hidden comment: 22мк)
C32  Voltage: 16B  [C1210]  (hidden comment: 22мк)
C33  Voltage: 16B  [C1210]  (hidden comment: 22мк)
C34  Voltage: 16B  [C1210]  (hidden comment: 22мк)
C35  Voltage: 16B  [C1210]  (hidden comment: 22мк)
C36  Voltage: 16B  [C1210]  (hidden comment: 22мк)
C37  Voltage: 16B  [C1210]  (hidden comment: 22мк)
C38  Voltage: 16B  [C1210]  (hidden comment: 22мк)
C39  Voltage: 16B  [C1210]  (hidden comment: 22мк)
C40  Voltage: 16B  [C1210]  (hidden comment: 22мк)
C41  Voltage: 16B  [C1210]  (hidden comment: 22мк)
DD5  TPS54560DDAR  [SO Powerpad8]
DD6  TPS54560DDAR  [SO Powerpad8]
L1  value 15мкГн  Rated Current: 4,5A  [IND_12.5x12.5]  (hidden comment: Inductor)
L2  value 15мкГн  Rated Current: 4,5A  [IND_12.5x12.5]  (hidden comment: Inductor)
R26  value 0  [R0805]  (hidden comment: Resistor_0,125Вт)
R27  value 0  [R0805]  (hidden comment: Resistor_0,125Вт)
R28  value 243к  [R0805]  (hidden comment: Resistor_0,125Вт)
R29  value 243к  [R0805]  (hidden comment: Resistor_0,125Вт)
R30  value 16,9к  [R0805]  (hidden comment: Resistor_0,125Вт)
R31  value 16,9к  [R0805]  (hidden comment: Resistor_0,125Вт)
R32  value 330  [R0805]  (hidden comment: Resistor_0,125Вт)
R33  value 330  [R0805]  (hidden comment: Resistor_0,125Вт)
R34  value 53,6к  [R0805]  (hidden comment: Resistor_0,125Вт)
R35  value 10,2к  [R0805]  (hidden comment: Resistor_0,125Вт)
R36  value 53,6к  [R0805]  (hidden comment: Resistor_0,125Вт)
R37  value 10,2к  [R0805]  (hidden comment: Resistor_0,125Вт)
VD16  B560C  [SMC]
VD17  B560C  [SMC]
VD18  TO-1608BC-PG  [L_0603_GREEN]
VD19  TO-1608BC-PG  [L_0603_GREEN]
VD20  SMBJ5.A  [SMB]
VD21  SMBJ5.A  [SMB]

### Nets
+5B_DISP: C30.2 C32.2 C34.2 C36.2 C38.2 C40.2 L1.2 R32.2 R34.2 VD20.1(K)
+5B_RASP: C31.2 C33.2 C35.2 C37.2 C39.2 C41.2 L2.2 R33.2 R36.2 VD21.1(K)
+24B_TERM: C16.1 C17.2 C18.1 C19.2 C20.1 C21.2 C22.1 C23.2 DD5.2(Vin) DD6.2(Vin)
PGND: C16.2 C17.1 C18.2 C19.1 C20.2 C21.1 C22.2 C23.1 C26.1 C27.1 C28.1 C29.1 C30.1 C31.1 C32.1 C33.1 C34.1 C35.1 C36.1 C37.1 C38.1 C39.1 C40.1 C41.1 DD5.7(GND) DD5.9(PWRPAD) DD6.7(GND) DD6.9(PWRPAD) R26.2 R27.2 R28.1 R29.1 R35.1 R37.1 VD16.2(A) VD17.2(A) VD18.1(K) VD19.1(K) VD20.2(A) VD21.2(A)
NetC24_1: C24.1 DD5.8(SW) L1.1 VD16.1(K)
NetC24_2: C24.2 DD5.1(BOOT)
NetC25_1: C25.1 DD6.8(SW) L2.1 VD17.1(K)
NetC25_2: C25.2 DD6.1(BOOT)
NetC26_2: C26.2 R30.1
NetC27_2: C27.2 R31.1
NetC28_2: C28.2 DD5.6(COMP) R30.2
NetC29_2: C29.2 DD6.6(COMP) R31.2
NetDD5_3: DD5.3(EN) R26.1
NetDD5_4: DD5.4(RT/CLK) R28.2
NetDD5_5: DD5.5(FB) R34.1 R35.2
NetDD6_3: DD6.3(EN) R27.1
NetDD6_4: DD6.4(RT/CLK) R29.2
NetDD6_5: DD6.5(FB) R36.1 R37.2
NetR32_1: R32.1 VD18.2(A)
NetR33_1: R33.1 VD19.2(A)

### Notes on the sheet
- Потребление дисплея 3А
- Пульс значение тока 0,77А
- Частота 400 кГц
- Потребление распберри 3А
- Подп. и дата
- Инв. № дубл.
- н/к
- Взам. инв. №
- Разраб.
- Инв. № подл.
- Лист
- Изм.
- № докум.
- Подп.
- Дата
- Копировал
- Формат
- (in symbol pwr177) DC

### Library data of the parts
C16-C23 = cap351: Конденсатор; Part Name: MLCC; Manufacture: Samsung; Part Number: CL31B225KBHNNNE; id: cap351; TKE: X7R; tga: 0.10%; Value: 2,2мк
C24 C25 = cap141: as C3 on sheet REUN.468349.001_PSU_Board_Logic; Value: 0,1мк
C26 C27 = cap354: Конденсатор; Part Name: Ceramic; Manufacture: Yageo; Part Number: CC0805KRX7R9BB472; id: cap354; TKE: X7R; tga: 0.10%; Value: 4700
C28 C29 = cap353: Конденсатор; Part Name: Ceramic; Manufacture: Yageo; Part Number: CC0805JRNPO9BN470; id: cap353; TKE: NP0; tga: 0.05%; Value: 47
C30-C41 = cap352: Конденсатор; Part Name: MLCC; Manufacture: Samsung; Part Number: CL32B226KOJNNNE; id: cap352; TKE: X7R; tga: 0.10%; Value: 22мк
DD5 DD6 = pwr177: 5-A, Wide Input Range, Step-Down Converter; Part Name: Step Down DC-DC Converter with Eco-mode; Manufacturer: Texas Instruments; id: pwr177; Input Voltage: 4,5-60В; Output Voltage: 0,8B-58,8B; Current: 5A; Frequency: 100 kHz-25 MHz; Type: Impulse; Part Number: TPS54560DDAR
L1 L2 = ind78: EMI Suppression Filter; Part Name: SMD Power Inductors; Part Number: B82477G4153M000; Manufacture: Epcos; id: ind78; Saturation Current: 5,25A; Resistance: 0,027Ohm
R26 R27 = res25: Резистор; Manufacture: Yageo; Part Number: RC0805FR-070RL; id: res49; Accuracy: 0.01; Part Name: Resistor; Power: 0,125Вт
R28 R29 = res1226: Резистор; Manufacture: Yageo; Part Number: RC0805FR-07243KL; Accuracy: 0.01; id: res1226; Part Name: Resistor; Power: 0,125Вт
R30 R31 = res1186: Резистор; Manufacture: Yageo; Part Number: RC0805FR-0716K9L; Accuracy: 0.01; id: res1186; Part Name: Resistor; Power: 0,125Вт
R32 R33 = res62: Резистор; Manufacture: Yageo; Part Number: RC0805FR-07330RL; id: res62; Accuracy: 0.01; Part Name: Resistor; Power: 0,125Вт
R34 R36 = res1234: Резистор; Manufacture: Yageo; Part Number: RC0805FR-0753K6L; Accuracy: 0.01; id: res1234; Part Name: Resistor; Power: 0,125Вт
R35 R37 = res1230: Резистор; Manufacture: Yageo; Part Number: RC0805FR-0710K2L; Accuracy: 0.01; id: res1230; Part Name: Resistor; Power: 0,125Вт
VD16 VD17 = diode32: Диод Шоттки; Part Name: SCHOTTKY BARRIER RECTIFIER; Manufacture: Diodes Incorporated; Max Reverse Voltage: 60B; Forward Voltage: 0,7B; Forward Current: 5A; Reverse Current: 20mA; Capacitance: 300pF; Number: 1; id: diode32; Temp MAX: +150; Temp MIN: -55; Part Number: B560C
VD18 VD19 = diode43: as VD5 on sheet REUN.468349.001_PSU_Board_Power; id: diode43; Part Number: TO-1608BC-PG
VD20 VD21 = SMBJ5.A: Cтабилитрон (лавинный выпрямительный диод) односторонний; Part Name: TVS diode Unidirectional; Manufacture: ST Microelectronics; id: tvs68; Leakage Current: 20uA; Stand-off Voltage: 5B; Breakdown Voltage: 6,74B; Clamping voltage: 9,2B; Dynamic resistance: 0,031Ohm; Peak Pulse Power: 600W; Number of diodes: 1; Part Number: SMBJ5.A

## Sheet REUN.468349.001_PSU_Board_12B_Interface.SchDoc
size 420 x 297 mm; DocumentNumber: РЕУН.468349.001 Э3 2D; SheetNumber: 7; Format: A3
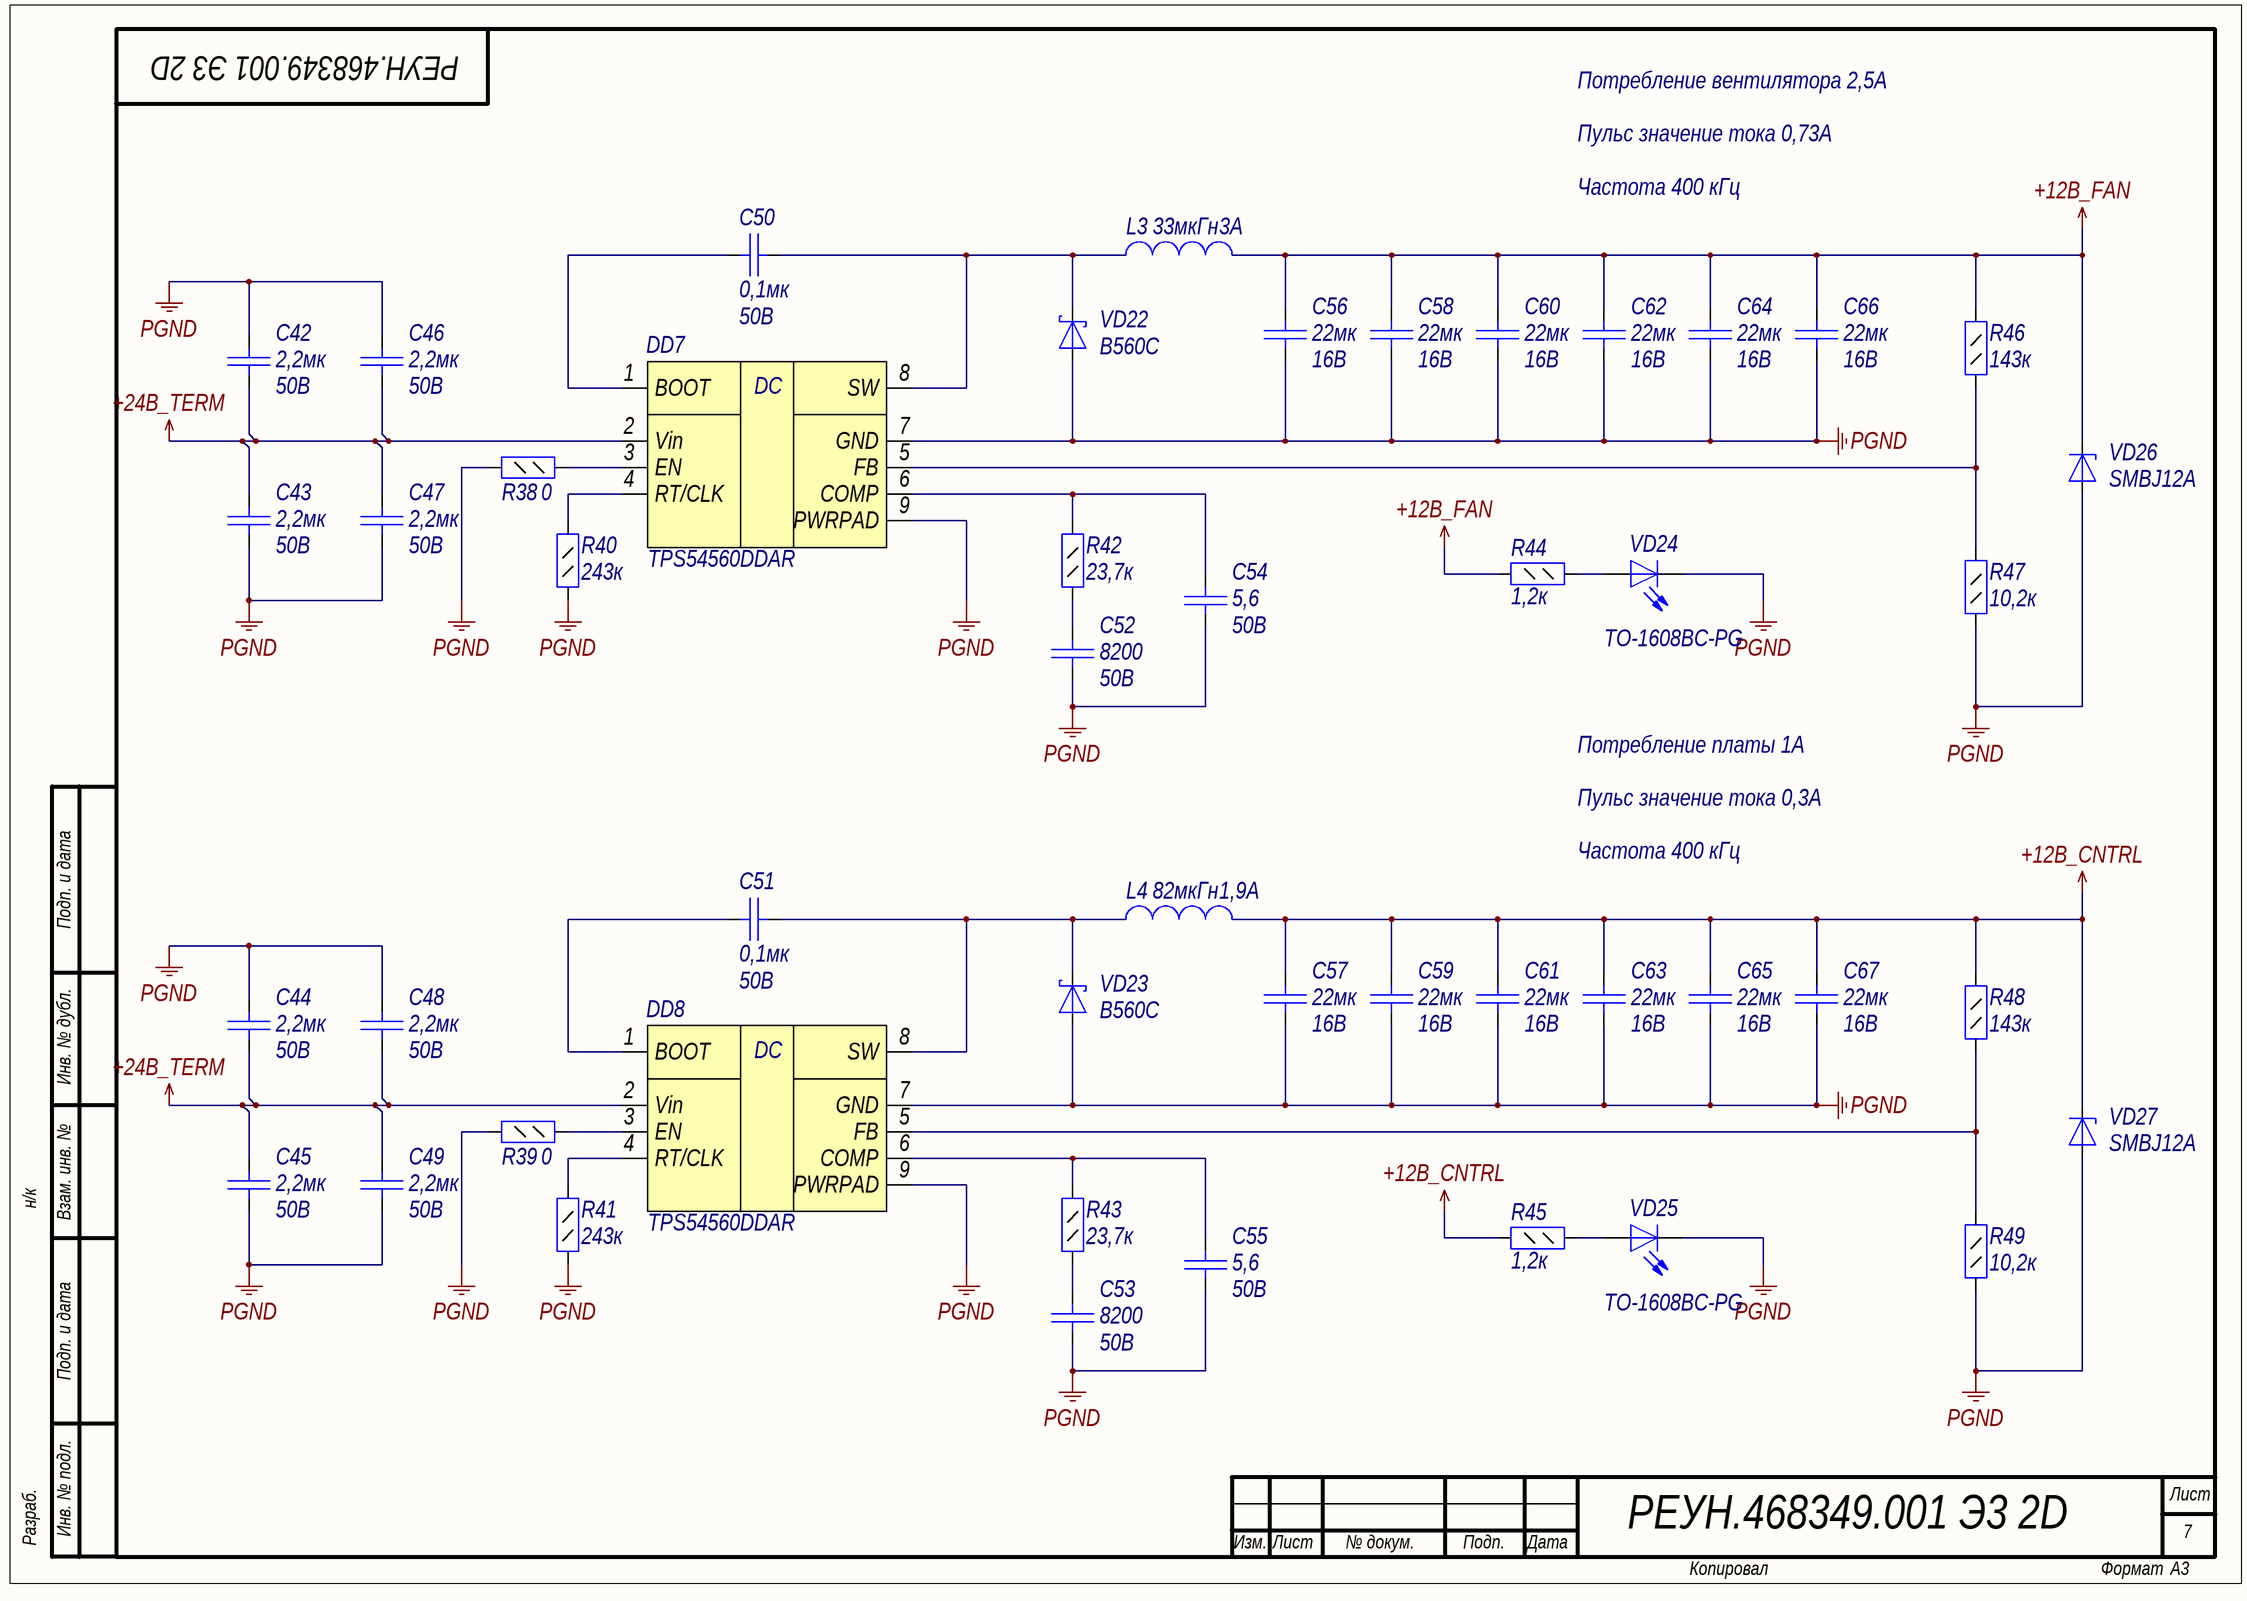
[diagram p6: REUN.468349.001_PSU_Board_12B_Interface.SchDoc]

### Parts
C42  Voltage: 50B  [C1206]  (hidden comment: 2,2мк)
C43  Voltage: 50B  [C1206]  (hidden comment: 2,2мк)
C44  Voltage: 50B  [C1206]  (hidden comment: 2,2мк)
C45  Voltage: 50B  [C1206]  (hidden comment: 2,2мк)
C46  Voltage: 50B  [C1206]  (hidden comment: 2,2мк)
C47  Voltage: 50B  [C1206]  (hidden comment: 2,2мк)
C48  Voltage: 50B  [C1206]  (hidden comment: 2,2мк)
C49  Voltage: 50B  [C1206]  (hidden comment: 2,2мк)
C50  Voltage: 50B  [C0805]  (hidden comment: 0,1мк)
C51  Voltage: 50B  [C0805]  (hidden comment: 0,1мк)
C52  Voltage: 50В  [C0805]  (hidden comment: 8200)
C53  Voltage: 50В  [C0805]  (hidden comment: 8200)
C54  Voltage: 50B  [C0805]  (hidden comment: 5,6)
C55  Voltage: 50B  [C0805]  (hidden comment: 5,6)
C56  Voltage: 16B  [C1210]  (hidden comment: 22мк)
C57  Voltage: 16B  [C1210]  (hidden comment: 22мк)
C58  Voltage: 16B  [C1210]  (hidden comment: 22мк)
C59  Voltage: 16B  [C1210]  (hidden comment: 22мк)
C60  Voltage: 16B  [C1210]  (hidden comment: 22мк)
C61  Voltage: 16B  [C1210]  (hidden comment: 22мк)
C62  Voltage: 16B  [C1210]  (hidden comment: 22мк)
C63  Voltage: 16B  [C1210]  (hidden comment: 22мк)
C64  Voltage: 16B  [C1210]  (hidden comment: 22мк)
C65  Voltage: 16B  [C1210]  (hidden comment: 22мк)
C66  Voltage: 16B  [C1210]  (hidden comment: 22мк)
C67  Voltage: 16B  [C1210]  (hidden comment: 22мк)
DD7  TPS54560DDAR  [SO Powerpad8]
DD8  TPS54560DDAR  [SO Powerpad8]
L3  value 33мкГн  Rated Current: 3A  [IND_12.5x12.5]  (hidden comment: Inductor)
L4  value 82мкГн  Rated Current: 1,9A  [IND_12.5x12.5]  (hidden comment: Inductor)
R38  value 0  [R0805]  (hidden comment: Resistor_0,125Вт)
R39  value 0  [R0805]  (hidden comment: Resistor_0,125Вт)
R40  value 243к  [R0805]  (hidden comment: Resistor_0,125Вт)
R41  value 243к  [R0805]  (hidden comment: Resistor_0,125Вт)
R42  value 23,7к  [R0805]  (hidden comment: Resistor_0,125Вт)
R43  value 23,7к  [R0805]  (hidden comment: Resistor_0,125Вт)
R44  value 1,2к  [R0805]  (hidden comment: Resistor_0,125Вт)
R45  value 1,2к  [R0805]  (hidden comment: Resistor_0,125Вт)
R46  value 143к  [R0805]  (hidden comment: Resistor_0,125Вт)
R47  value 10,2к  [R0805]  (hidden comment: Resistor_0,125Вт)
R48  value 143к  [R0805]  (hidden comment: Resistor_0,125Вт)
R49  value 10,2к  [R0805]  (hidden comment: Resistor_0,125Вт)
VD22  B560C  [SMC]
VD23  B560C  [SMC]
VD24  TO-1608BC-PG  [L_0603_GREEN]
VD25  TO-1608BC-PG  [L_0603_GREEN]
VD26  SMBJ12A  [SMB]
VD27  SMBJ12A  [SMB]

### Nets
+12B_CNTRL: C57.2 C59.2 C61.2 C63.2 C65.2 C67.2 L4.2 R45.2 R48.2 VD27.1(K)
+12B_FAN: C56.2 C58.2 C60.2 C62.2 C64.2 C66.2 L3.2 R44.2 R46.2 VD26.1(K)
+24B_TERM: C42.1 C43.2 C44.1 C45.2 C46.1 C47.2 C48.1 C49.2 DD7.2(Vin) DD8.2(Vin)
PGND: C42.2 C43.1 C44.2 C45.1 C46.2 C47.1 C48.2 C49.1 C52.1 C53.1 C54.1 C55.1 C56.1 C57.1 C58.1 C59.1 C60.1 C61.1 C62.1 C63.1 C64.1 C65.1 C66.1 C67.1 DD7.7(GND) DD7.9(PWRPAD) DD8.7(GND) DD8.9(PWRPAD) R38.2 R39.2 R40.1 R41.1 R47.1 R49.1 VD22.2(A) VD23.2(A) VD24.1(K) VD25.1(K) VD26.2(A) VD27.2(A)
NetC50_1: C50.1 DD7.8(SW) L3.1 VD22.1(K)
NetC50_2: C50.2 DD7.1(BOOT)
NetC51_1: C51.1 DD8.8(SW) L4.1 VD23.1(K)
NetC51_2: C51.2 DD8.1(BOOT)
NetC52_2: C52.2 R42.1
NetC53_2: C53.2 R43.1
NetC54_2: C54.2 DD7.6(COMP) R42.2
NetC55_2: C55.2 DD8.6(COMP) R43.2
NetDD7_3: DD7.3(EN) R38.1
NetDD7_4: DD7.4(RT/CLK) R40.2
NetDD7_5: DD7.5(FB) R46.1 R47.2
NetDD8_3: DD8.3(EN) R39.1
NetDD8_4: DD8.4(RT/CLK) R41.2
NetDD8_5: DD8.5(FB) R48.1 R49.2
NetR44_1: R44.1 VD24.2(A)
NetR45_1: R45.1 VD25.2(A)

### Notes on the sheet
- Потребление вентилятора 2,5А
- Пульс значение тока 0,73А
- Частота 400 кГц
- Потребление платы 1А
- Пульс значение тока 0,3А
- Подп. и дата
- Инв. № дубл.
- н/к
- Взам. инв. №
- Разраб.
- Инв. № подл.
- Лист
- Изм.
- № докум.
- Подп.
- Дата
- Копировал
- Формат
- (in symbol pwr177) DC

### Library data of the parts
C42-C49 = cap351: as C16 on sheet REUN.468349.001_PSU_Board_5B_Interface; Value: 2,2мк
C50 C51 = cap141: as C3 on sheet REUN.468349.001_PSU_Board_Logic; Value: 0,1мк
C52 C53 = cap171: Конденсатор; Part Name: Ceramic; Manufacture: Murata; Part Number: GRM216R71H822KA01D; id: cap171; TKE: X7R; Value: 8200
C54 C55 = cap355: Конденсатор; Part Name: Ceramic; Manufacture: Samsung; Part Number: CL21C5R6CBANNNC; id: cap355; TKE: NP0; tga: 0.05%; Value: 5,6
C56-C67 = cap352: as C30 on sheet REUN.468349.001_PSU_Board_5B_Interface; Value: 22мк
DD7 DD8 = pwr177: as DD5 on sheet REUN.468349.001_PSU_Board_5B_Interface; Type: Impulse; Part Number: TPS54560DDAR
L3 = ind80: EMI Suppression Filter; Part Name: SMD Power Inductors; Part Number: B82477G4333M000; Manufacture: Epcos; id: ind80; Saturation Current: 3,5A; Resistance: 0,053Ohm
L4 = ind83: EMI Suppression Filter; Part Name: SMD Power Inductors; Part Number: B82477G4823M000; Manufacture: Epcos; id: ind83; Saturation Current: 2,25A; Resistance: 0,145Ohm
R38 R39 = res25: as R26 on sheet REUN.468349.001_PSU_Board_5B_Interface; Part Name: Resistor; Power: 0,125Вт
R40 R41 = res1226: as R28 on sheet REUN.468349.001_PSU_Board_5B_Interface; id: res1226; Part Name: Resistor; Power: 0,125Вт
R42 R43 = res1173: Резистор; Manufacture: Yageo; Part Number: RC0805FR-0723K7L; Accuracy: 0.01; id: res1173; Part Name: Resistor; Power: 0,125Вт
R44 R45 = res78: Резистор; Manufacture: Yageo; Part Number: RC0805FR-071K2; id: res78; Accuracy: 0.01; Part Name: Resistor; Power: 0,125Вт
R46 R48 = res1253: Резистор; Manufacture: Yageo; Part Number: RC0805FR-07143KL; Accuracy: 0.01; id: res1253; Part Name: Resistor; Power: 0,125Вт
R47 R49 = res1230: as R35 on sheet REUN.468349.001_PSU_Board_5B_Interface; id: res1230; Part Name: Resistor; Power: 0,125Вт
VD22 VD23 = diode32: as VD16 on sheet REUN.468349.001_PSU_Board_5B_Interface; id: diode32; Temp MAX: +150; Temp MIN: -55; Part Number: B560C
VD24 VD25 = diode43: as VD5 on sheet REUN.468349.001_PSU_Board_Power; id: diode43; Part Number: TO-1608BC-PG
VD26 VD27 = SMBJ12A: Cтабилитрон (лавинный выпрямительный диод) односторонний; Part Name: TVS diode Unidirectional; Manufacture: ST Microelectronics; id: tvs73; Leakage Current: 0,2uA; Stand-off Voltage: 12B; Breakdown Voltage: 14B; Clamping voltage: 19,9B; Dynamic resistance: 0,168Ohm; Peak Pulse Power: 600W; Number of diodes: 1; Part Number: SMBJ12A

## Nets that join several sheets
+3,3B_LOGIC: REUN.468349.001_PSU_Board_Power (R5.1 R6.1), REUN.468349.001_PSU_Board_Logic (5 pins), REUN.468349.001_PSU_Board_Button (7 pins), REUN.468349.001_PSU_Board_3V3_Logic (C14.2 C15.2 DA1.1 R25.2)
+5B_DISP: REUN.468349.001_PSU_Board_Connectors (X9.1 X9.2), REUN.468349.001_PSU_Board_5B_Interface (10 pins)
+5B_RASP: REUN.468349.001_PSU_Board_Connectors (X10.1 X10.2), REUN.468349.001_PSU_Board_5B_Interface (10 pins)
+12B_CNTRL: REUN.468349.001_PSU_Board_Connectors (X12.1 X12.2), REUN.468349.001_PSU_Board_12B_Interface (10 pins)
+12B_FAN: REUN.468349.001_PSU_Board_Connectors (X11.1 X11.2), REUN.468349.001_PSU_Board_12B_Interface (10 pins)
+24B_DRIVE: REUN.468349.001_PSU_Board_Connectors (X14.1), REUN.468349.001_PSU_Board_Power (7 pins)
+24B_IN1: REUN.468349.001_PSU_Board_Connectors (X1.1 X3.1), REUN.468349.001_PSU_Board_Power (FU1.1)
+24B_IN2: REUN.468349.001_PSU_Board_Connectors (X2.1), REUN.468349.001_PSU_Board_Power (FU2.1)
+24B_TERM: REUN.468349.001_PSU_Board_Connectors (X4.1 X8.1 X13.1), REUN.468349.001_PSU_Board_Power (7 pins), REUN.468349.001_PSU_Board_5B_Interface (10 pins), REUN.468349.001_PSU_Board_12B_Interface (10 pins)
PGND: REUN.468349.001_PSU_Board_Connectors (18 pins), REUN.468349.001_PSU_Board_Power (10 pins), REUN.468349.001_PSU_Board_Logic (17 pins), REUN.468349.001_PSU_Board_Button (8 pins), REUN.468349.001_PSU_Board_3V3_Logic (6 pins), REUN.468349.001_PSU_Board_5B_Interface (40 pins), REUN.468349.001_PSU_Board_12B_Interface (40 pins)
NetC11_2: REUN.468349.001_PSU_Board_Logic (DD3.1 DD3.4), REUN.468349.001_PSU_Board_Button (C11.2 DD4.6 R21.2 R23.1)
NetC12_1: REUN.468349.001_PSU_Board_Power (6 pins), REUN.468349.001_PSU_Board_3V3_Logic (C12.1 C13.1 DA1.3)
NetDD3_3: REUN.468349.001_PSU_Board_Power (R1.1), REUN.468349.001_PSU_Board_Logic (DD3.3)
NetDD3_6: REUN.468349.001_PSU_Board_Power (R2.1), REUN.468349.001_PSU_Board_Logic (DD3.6)
NetDD4_5: REUN.468349.001_PSU_Board_Connectors (X7.1), REUN.468349.001_PSU_Board_Button (DD4.5 R22.1)
NetFU3_2: REUN.468349.001_PSU_Board_Connectors (X15.1), REUN.468349.001_PSU_Board_Logic (FU3.2)
NetFU4_2: REUN.468349.001_PSU_Board_Connectors (X16.1), REUN.468349.001_PSU_Board_Logic (FU4.2)
NetR19_1: REUN.468349.001_PSU_Board_Connectors (X6.1), REUN.468349.001_PSU_Board_Button (R19.1 VD13.1)
NetR21_1: REUN.468349.001_PSU_Board_Connectors (X5.1), REUN.468349.001_PSU_Board_Button (R21.1 VD14.1)
NetVD7_2: REUN.468349.001_PSU_Board_Connectors (X3.2), REUN.468349.001_PSU_Board_Logic (VD7.2)
NetVD8_2: REUN.468349.001_PSU_Board_Connectors (X4.2), REUN.468349.001_PSU_Board_Logic (VD8.2)